# Altium project FLEXI_HAL_Quark.PrjPCB (part 2 of 5)

## Sheet 2CH_Digital_Isolator.SchDoc: STM32F446 CNC
size B; Author: AM; CompanyName: Expatria Technologies; DrawnBy: A.Marles; Engineer: AM; Organization: Expatria Technolgoies; DocumentNumber: 9; Revision: A1; SheetNumber: 9; SheetTotal: 14
Used 16 times, as channels STM32F446 CNC Controller/ST/AO, STM32F446 CNC Controller/ST/AO, STM32F446 CNC Controller/4 Encoder Inputs/EI, STM32F446 CNC Controller/4 Encoder Inputs/EI, STM32F446 CNC Controller/4 Encoder Inputs/EI, STM32F446 CNC Controller/4 Encoder Inputs/EI, STM32F446 CNC Controller/4 Encoder Inputs/EI, STM32F446 CNC Controller/4 Encoder Inputs/EI, STM32F446 CNC Controller/Mezzanine Connector/AUX_I/AI, STM32F446 CNC Controller/Mezzanine Connector/AUX_I/AI, STM32F446 CNC Controller/Mezzanine Connector/MZ, STM32F446 CNC Controller/Mezzanine Connector/MZ, STM32F446 CNC Controller/Mezzanine Connector/MZ, STM32F446 CNC Controller/Mezzanine Connector/MZ, STM32F446 CNC Controller/Mezzanine Connector/MZ, STM32F446 CNC Controller/Mezzanine Connector/MZ. Parts and nets are listed once, with the designators drawn on the sheet.
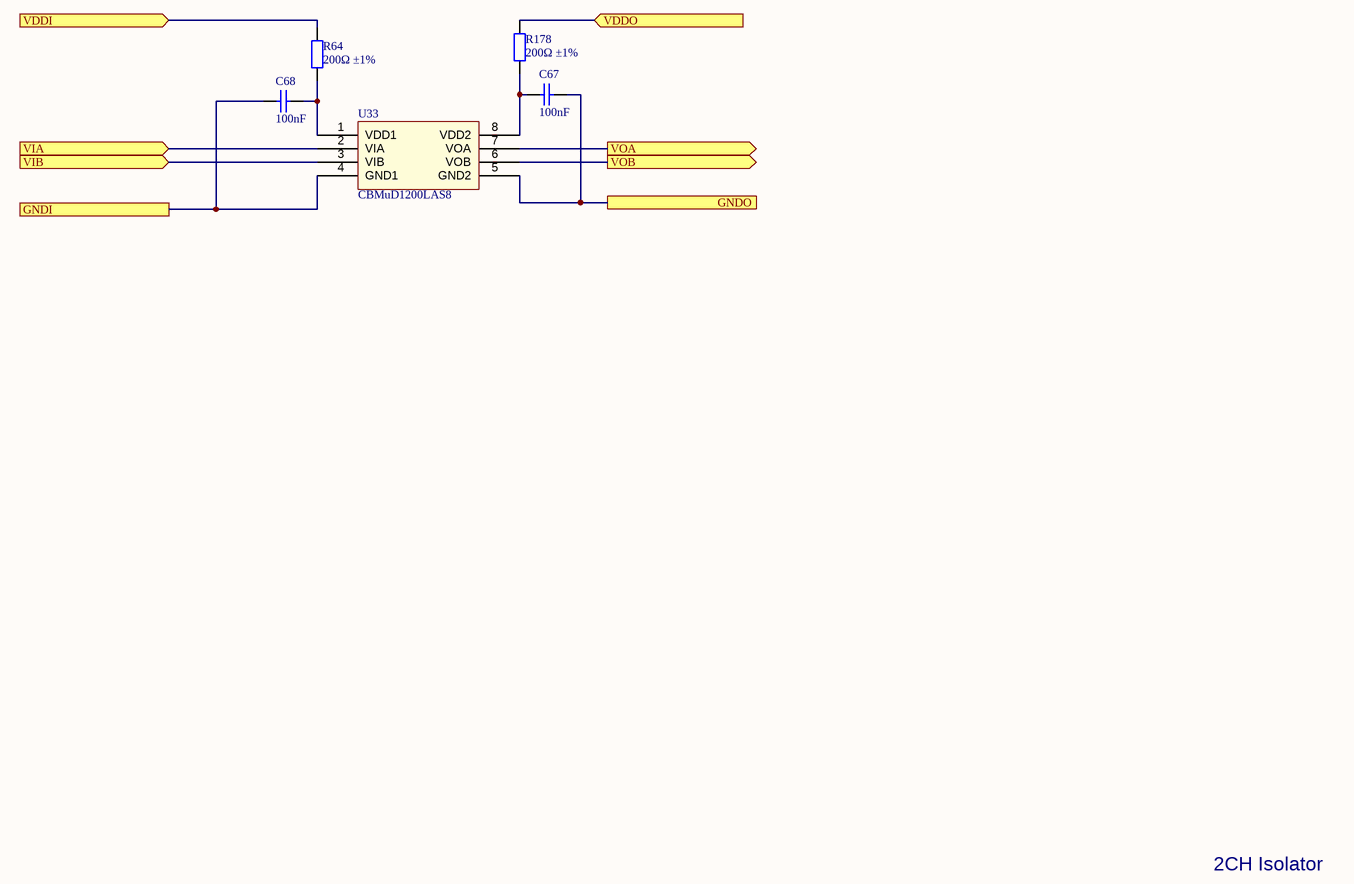
[diagram p4: 2CH_Digital_Isolator.SchDoc]

### Parts
C67  100nF  [0603_C]
C68  100nF  [0603_C]
R64  200Ω ±1%  [0603_R]
R178  200Ω ±1%  [0603_R]
U33  CBMuD1200LAS8  [SOIC-8_150mil]

### Ports
GNDI, GNDO, VDDI (in), VDDO (in), VIA (in), VIB (in), VOA (out), VOB (out)

### Nets
GNDI: C68.2 U33.4(GND1) ; port GNDI
GNDO: C67.1 U33.5(GND2) ; port GNDO
VDDI: R64.2 ; port VDDI
VDDO: R178.2 ; port VDDO
VIA: U33.2(VIA) ; port VIA
VIB: U33.3(VIB) ; port VIB
VOA: U33.7(VOA) ; port VOA
VOB: U33.6(VOB) ; port VOB
NetC67_2: C67.2 R178.1 U33.8(VDD2)
NetC68_1: C68.1 R64.1 U33.1(VDD1)

### Channels
STM32F446 CNC Controller/ST/AO: designators end in _STM32F446_CNC_Controller_ST_AO#1; ports GNDI=MCU_GND GNDO=GND VDDI=+3.3V VDDO=+5V VIA=SPI_MOTOR.SPI_CLK VIB=SPI_MOTOR.SPI_PICO VOA=STP_SCK_5V VOB=STP_SDI_5V
STM32F446 CNC Controller/ST/AO: designators end in _STM32F446_CNC_Controller_ST_AO#2; ports GNDI=GND GNDO=MCU_GND VDDI=+5V VDDO=+3.3V VIA=STP_SDO_5V VIB=VIB_AO VOA=SPI_MOTOR.SPI_POCI VOB=VOB_AO
STM32F446 CNC Controller/4 Encoder Inputs/EI: designators end in _STM32F446_CNC_Controller_4_Encoder_Inputs_EI#1; ports GNDI=GND GNDO=MCU_GND VDDI=+5V VDDO=+3.3V VIA=VIA VIB=VIB VOA=ENC0_A_3V3 VOB=ENC0_B_3V3
STM32F446 CNC Controller/4 Encoder Inputs/EI: designators end in _STM32F446_CNC_Controller_4_Encoder_Inputs_EI#2; ports GNDI=GND GNDO=MCU_GND VDDI=+5V VDDO=+3.3V VIA=VIA VIB=VIB VOA=ENC0_Z_3V3 VOB=ENC1_Z_3V3
STM32F446 CNC Controller/4 Encoder Inputs/EI: designators end in _STM32F446_CNC_Controller_4_Encoder_Inputs_EI#3; ports GNDI=GND GNDO=MCU_GND VDDI=+5V VDDO=+3.3V VIA=VIA VIB=VIB VOA=ENC1_B_3V3 VOB=ENC2_B_3V3
STM32F446 CNC Controller/4 Encoder Inputs/EI: designators end in _STM32F446_CNC_Controller_4_Encoder_Inputs_EI#4; ports GNDI=GND GNDO=MCU_GND VDDI=+5V VDDO=+3.3V VIA=VIA VIB=VIB VOA=ENC1_A_3V3 VOB=ENC2_Z_3V3
STM32F446 CNC Controller/4 Encoder Inputs/EI: designators end in _STM32F446_CNC_Controller_4_Encoder_Inputs_EI#5; ports GNDI=GND GNDO=MCU_GND VDDI=+5V VDDO=+3.3V VIA=VIA VIB=VIB VOA=ENC2_A_3V3 VOB=ENC3_A_3V3
STM32F446 CNC Controller/4 Encoder Inputs/EI: designators end in _STM32F446_CNC_Controller_4_Encoder_Inputs_EI#6; ports GNDI=GND GNDO=MCU_GND VDDI=+5V VDDO=+3.3V VIA=VIA VIB=VIB VOA=ENC3_Z_3V3 VOB=ENC3_B_3V3
STM32F446 CNC Controller/Mezzanine Connector/AUX_I/AI: designators end in _STM32F446_CNC_Controller_Mezzanine_Connector_AUX_I_AI#1; ports GNDI=GND GNDO=MCU_GND VDDI=+5V VDDO=+3.3V VIA=VIA VIB=VIB VOA=AUXIN_0 VOB=AUXIN_1
STM32F446 CNC Controller/Mezzanine Connector/AUX_I/AI: designators end in _STM32F446_CNC_Controller_Mezzanine_Connector_AUX_I_AI#2; ports GNDI=GND GNDO=MCU_GND VDDI=+5V VDDO=+3.3V VIA=VIA VIB=VIB VOA=AUXIN_2 VOB=AUXIN_3
STM32F446 CNC Controller/Mezzanine Connector/MZ: designators end in _STM32F446_CNC_Controller_Mezzanine_Connector_MZ#1; ports GNDI=MCU_GND GNDO=GND VDDI=+3.3V VDDO=+5V VIA=MIST VIB=COOLANT VOA=MIST_ISO VOB=COOLANT_ISO
STM32F446 CNC Controller/Mezzanine Connector/MZ: designators end in _STM32F446_CNC_Controller_Mezzanine_Connector_MZ#2; ports GNDI=MCU_GND GNDO=GND VDDI=+3.3V VDDO=+5V VIA=SPINDLE_EN VIB=SPINDLE_DIR VOA=SPINDLE_EN_ISO VOB=SPINDLE_DIR_ISO
STM32F446 CNC Controller/Mezzanine Connector/MZ: designators end in _STM32F446_CNC_Controller_Mezzanine_Connector_MZ#3; ports GNDI=MCU_GND GNDO=GND VDDI=+3.3V VDDO=+5V VIA=EXTRA_OUTPUT VIB=SPINDLE_PWM VOA=EXTRA_OUTPUT_ISO VOB=SPINDLE_PWM_ISO
STM32F446 CNC Controller/Mezzanine Connector/MZ: designators end in _STM32F446_CNC_Controller_Mezzanine_Connector_MZ#4; ports GNDI=MCU_GND GNDO=GND VDDI=+3.3V VDDO=+5V VIA=FASTO1 VIB=FASTO0 VOA=FASTO1_ISO VOB=FASTO0_ISO
STM32F446 CNC Controller/Mezzanine Connector/MZ: designators end in _STM32F446_CNC_Controller_Mezzanine_Connector_MZ#5; ports GNDI=MCU_GND GNDO=GND VDDI=+3.3V VDDO=+5V VIA=AUXOUT_2 VIB=AUXOUT_3 VOA=AUXOUT2_ISO VOB=AUXOUT3_ISO
STM32F446 CNC Controller/Mezzanine Connector/MZ: designators end in _STM32F446_CNC_Controller_Mezzanine_Connector_MZ#6; ports GNDI=MCU_GND GNDO=GND VDDI=+3.3V VDDO=+5V VIA=AUXOUT_0 VIB=AUXOUT_1 VOA=AUXOUT0_ISO VOB=AUXOUT1_ISO

### Notes on the sheet
- 2CH Isolator
- SHEET
- Expatria Technologies
- 1136 Glade Court
- Port Coquitlam, BC V3B 1R5
- PROJECT
- SIZE
- ENGR
- MODIFIED
- DOCUMENT
- REV
- Copyright Expatria Technologies 2022. This document describes Open Hardware and is licensed under the CERN-OHL-S v2. No warranty is implied or expressed.
- EMAIL: INFO@EXPATRIA.CA
- B
- /

### Library data of the parts
C67 C68 = 0603 100nF (104) 10% 50V: as C9 on sheet Stepper_driver_group; ComponentLink1Description: Supplier link; ComponentLink1URL: http://www.szlcsc.com/product/details_15331.html; Package: 0603; Supplier: LC; SuppliersPartNumber: C14663; Capacitance: 100nF
R64 R178 = 0603 200R (2000) 1%: Chip resistor; Manufacturer: Uniroyal Elec; PartNumber: 0603WAF2000T5E; Power: 1/10W; ComponentLink1Description: Supplier link; ComponentLink1URL: http://www.szlcsc.com/product/details_8708.html; Package: 0603; Supplier: LC; SuppliersPartNumber: C8218; Resistance: 200Ω; Tolerance: 1%
U33 = CBMuD1200LAS8: Dual Channel Isolator; Package: SOIC-8_150mil; Supplier: LC; SuppliersPartNumber: C476470; ComponentLink1Description: 供应商链接; ComponentLink1URL: http://www.szlcsc.com/product/details_10199.html

## Sheet RS485.SchDoc: RP2040 CNC
size B; Author: AM; CompanyName: Expatria Technologies; DrawnBy: A.Marles; Engineer: AM; Organization: Expatria Technolgoies; DocumentNumber: 6; Revision: A1; SheetNumber: 6; SheetTotal: 14
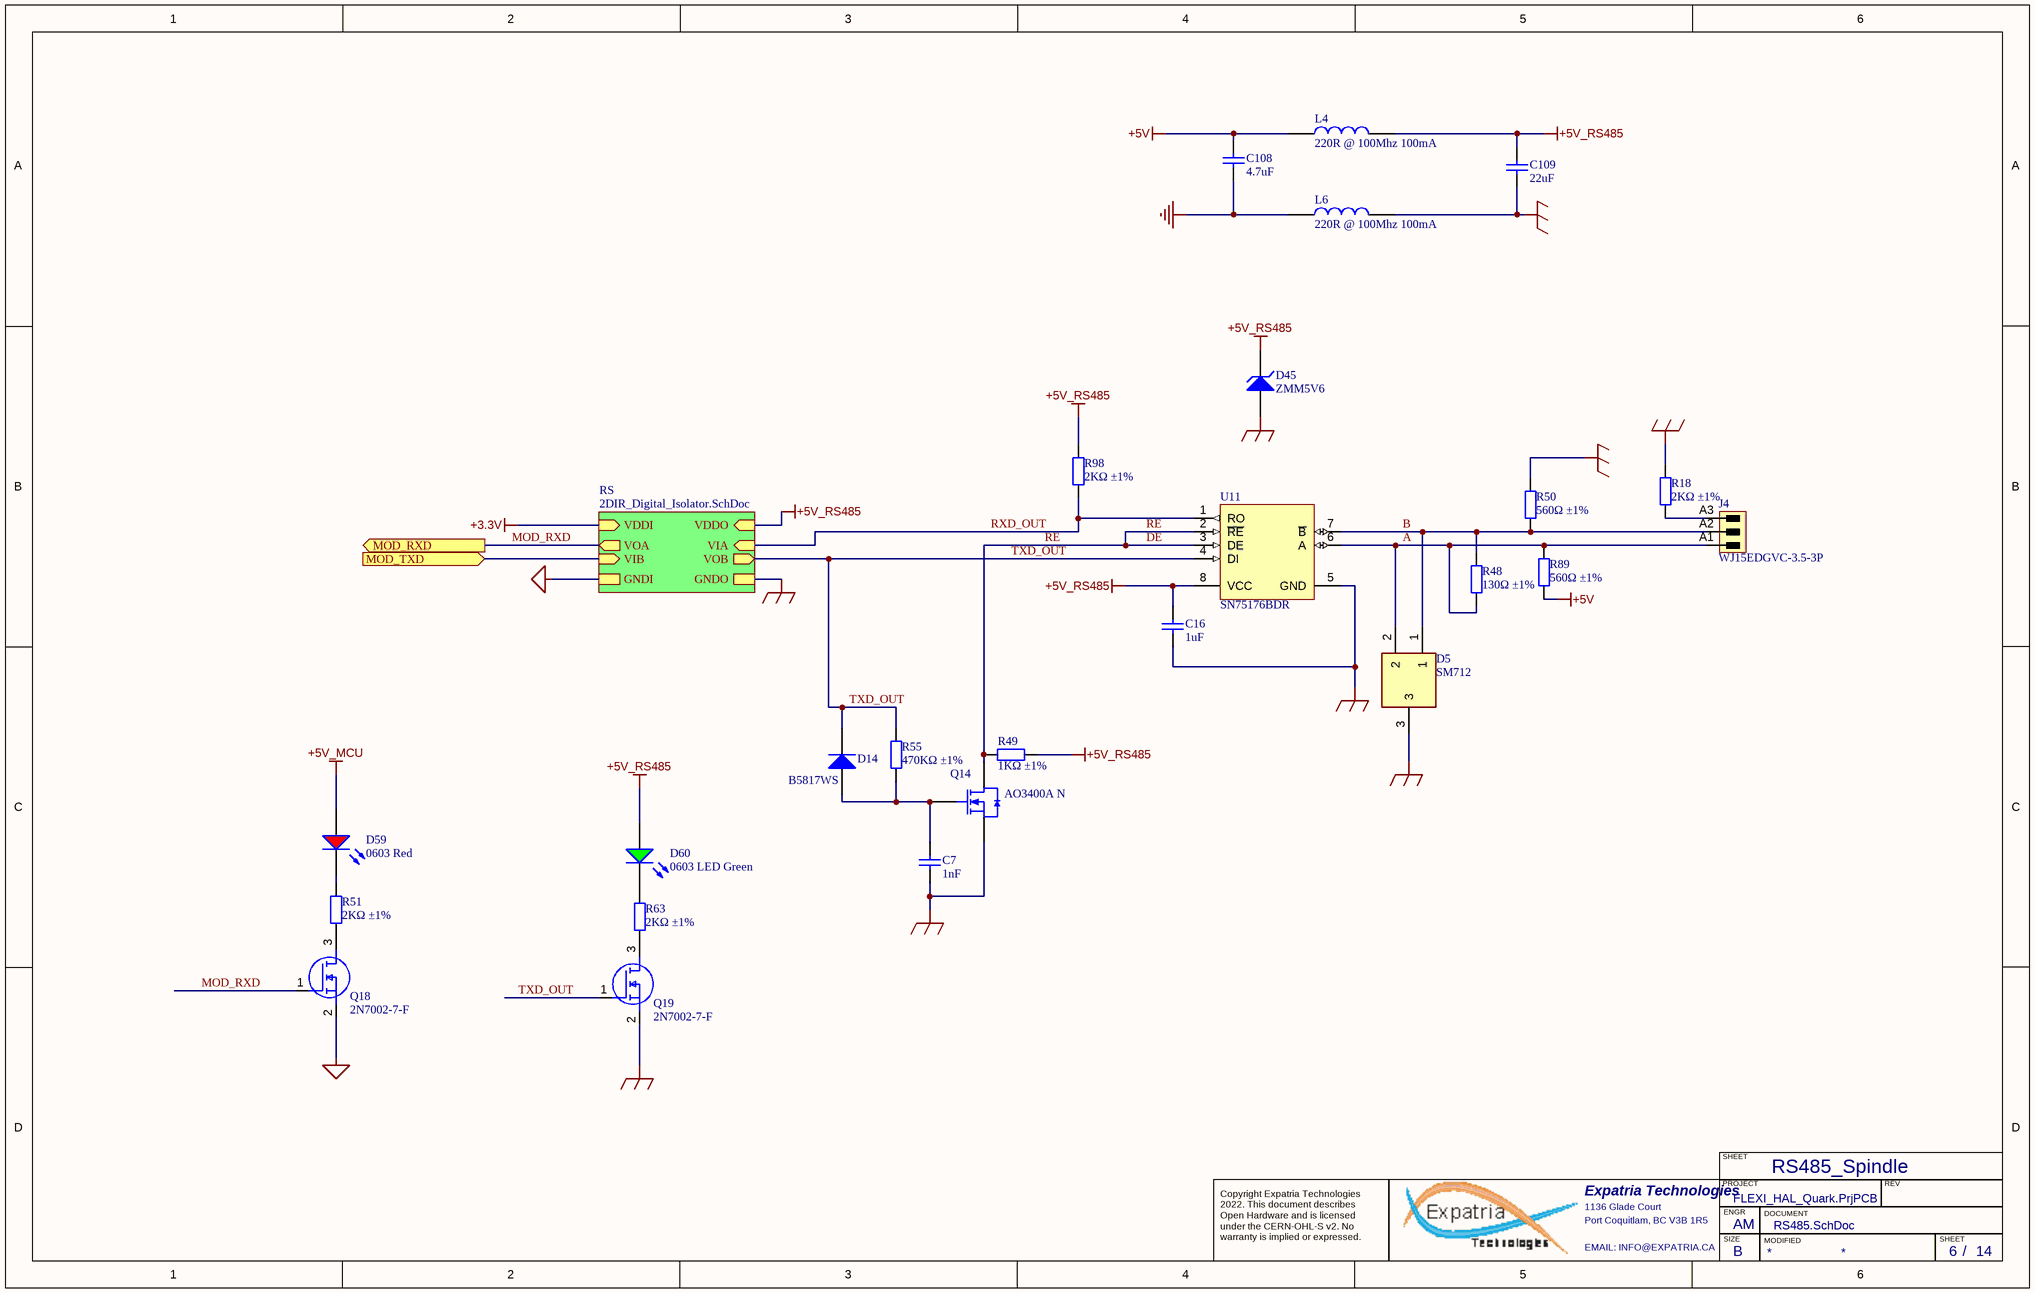
[diagram p5: RS485.SchDoc]

### Parts
C7  1nF  [0603_C]
C16  1uF  [0603_C]
C108  4.7uF  [0805_C]
C109  22uF  [0805_C]
D5  SM712  [SOT95P230X117-3N]
D14  B5817WS  [SOD-323]
D45  ZMM5V6  [LL-34]
D59  0603 Red  [0603_LED_S1]
D60  0603 LED Green  [0603_LED_S1]
J4  WJ15EDGVC-3.5-3P  [691321100003 - 3.5mm  3p]
L4  220R @ 100Mhz 100mA  [0402_L]
L6  220R @ 100Mhz 100mA  [0402_L]
Q14  AO3400A N  [SOT-23-3L]
Q18  2N7002-7-F  [SOT-23(SOT-23-3)]
Q19  2N7002-7-F  [SOT-23(SOT-23-3)]
R18  2KΩ ±1%  [0603_R]
R48  130Ω ±1%  [0603_R]
R49  1KΩ ±1%  [0603_R]
R50  560Ω ±1%  [0603_R]
R51  2KΩ ±1%  [0402_R]
R55  470KΩ ±1%  [0603_R]
R63  2KΩ ±1%  [0402_R]
R89  560Ω ±1%  [0603_R]
R98  2KΩ ±1%  [0603_R]
U11  SN75176BDR  [SOIC-8_150mil]

### Sub-sheets
RS = 2DIR_Digital_Isolator.SchDoc: VDDO (in), VIB (in), VIA (in), VOB (out), VOA (out), VDDI (in), GNDO, GNDI

### Ports
MOD_RXD (out), MOD_TXD (in)

### Nets
+5V: C108.2 L4.1 R89.2
+5V_MCU: D59.A
+5V_RS485: C16.2 C109.2 D45.2(K) D60.A L4.2 R49.1 R98.2 U11.8(VCC) ; sheet RS/VDDO
GND: C108.1 L6.1
MCU_GND: Q18.2(S) ; sheet RS/GNDI
MOD_GND: C7.2 C16.1 C109.1 D5.3 D45.1(A) L6.2 Q14.2(S) Q19.2(S) R18.1 R50.1 U11.5(GND) ; sheet RS/GNDO
A: D5.2 J4.A1 R48.1 R89.1 U11.6(A)
B: D5.1 J4.A2 R48.2 R50.2 U11.7(~{B})
DE: Q14.3(D) R49.2 U11.2(~{RE}) U11.3(DE)  [also labelled RE]
MOD_RXD: Q18.1(G) ; port MOD_RXD, sheet RS/VOA  [project net RXD_EXT]
RXD_OUT: R98.1 U11.1(RO) ; sheet RS/VIA
TXD_EXT: port MOD_TXD, sheet RS/VIB
TXD_OUT: D14.2(K) Q19.1(G) R55.1 U11.4(DI) ; sheet RS/VOB
NetC7_1: C7.1 D14.1(A) Q14.1(G) R55.2
NetD59_K: D59.K R51.2
NetD60_K: D60.K R63.2
NetJ4_A3: J4.A3 R18.2
NetQ18_3: Q18.3(D) R51.1
NetQ19_3: Q19.3(D) R63.1

### Notes on the sheet
- RS485_Spindle
- SHEET
- Expatria Technologies
- 1136 Glade Court
- Port Coquitlam, BC V3B 1R5
- PROJECT
- SIZE
- ENGR
- MODIFIED
- DOCUMENT
- REV
- Copyright Expatria Technologies 2022. This document describes Open Hardware and is licensed under the CERN-OHL-S v2. No warranty is implied or expressed.
- EMAIL: INFO@EXPATRIA.CA
- B
- /

### Library data of the parts
C7 = 0603 1nF (102) 10% 50V: Chip capacitors; Manufacturer: Samsung Electro-Mechanics; PartNumber: CL10B102KB8NNNC; Tolerance: 10%; Voltage: 50V; ComponentLink1Description: Supplier link; ComponentLink1URL: http://www.szlcsc.com/product/details_1940.html; Package: 0603; Supplier: LC; SuppliersPartNumber: C1588; Capacitance: 1nF
C16 = 0603 1uF (105) 10% 50V: Chip capacitors; Manufacturer: Samsung Electro-Mechanics; PartNumber: CL10A105KB8NNNC; Tolerance: 10%; Voltage: 50V; ComponentLink1Description: Supplier link; ComponentLink1URL: http://www.szlcsc.com/product/details_16531.html; Package: 0603; Supplier: LC; SuppliersPartNumber: C15849; Capacitance: 1uF
C108 = 0805 4.7uF (475) 10% 25V: Chip capacitors; Manufacturer: Samsung Electro-Mechanics; PartNumber: CL21A475KAQNNNE; Tolerance: 10%; Voltage: 25V; ComponentLink1Description: Supplier link; ComponentLink1URL: http://www.szlcsc.com/product/details_2131.html; Package: 0805; Supplier: LC; SuppliersPartNumber: C1779; Capacitance: 4.7uF
C109 = 0805 22uF (226) 20% 25V: Chip capacitors; Manufacturer: Samsung Electro-Mechanics; PartNumber: CL21A226MAQNNNE; Tolerance: 20%; Voltage: 25V; ComponentLink1Description: Supplier link; ComponentLink1URL: http://www.szlcsc.com/product/details_46786.html; Package: 0805; Supplier: LC; SuppliersPartNumber: C45783; Capacitance: 22uF
D5 = CDSOT23-SM712: Bidirectional 12V (Max), 7V (Max) 7.5V / 13.3V 10V / 20V 12A(8/20us) SOT-23-3 TVS RoHS; Manufacturer_Name: DOWO; Height: 1.17mm; Manufacturer_Part_Number: SM712; SuppliersPartNumber: C293966
D14 = SOD-123 B5819W  SL: 20V 750mV@3A 1A SOD-323 Schottky Barrier Diodes (SBD) ROHS; Package: SOD-323; Supplier: LC; SuppliersPartNumber: C699102
D45 = LL-34 ZMM5V6: 500mW - 0.1uA @ 1V 5.6V LL-34 Zener Diodes ROHS; ComponentLink1Description: 供应商链接; ComponentLink1URL: http://www.szlcsc.com/product/details_8541.html; Package: LL-34; Supplier: LC; SuppliersPartNumber: C8062
D59 = 19-213SURC/S530-A3/TR8: 20mA 632nm Colorless transparence 624nm~624nm -40℃~+85℃ Red 120° 60mW 0603 Light Emitting Diodes (LED) ROHS; Manufacturer: Everlight Elec; ComponentLink1Description: 供应商链接; ComponentLink1URL: http://www.szlcsc.com/product/details_2659.html; Package: 0603; Supplier: LC; SuppliersPartNumber: C72039; Color: Red; Supplier 1: LC; Supplier Part Number 1: C72039; Manufacturer Part Number: 19-213SURC/S530-A3/TR8
D60 = 19-217/GHC-YR1S2/3T: Colorless transparence -40℃~+85℃ 520nm~535nm Emerald 120° 110mW 0603 Light Emitting Diodes (LED) ROHS; Manufacturer: Everlight Elec; Package: 0603; Supplier: LC; SuppliersPartNumber: C72043; Color: Green; Manufacturer Part Number: 19-217/GHC-YR1S2/3T
J4 = 3.5mm Terminal Header 3p: Header,Male Pin,Covered(4 Sided) 3 1 0.138"（3.50mm） 3 P=3.5mm Pluggable System Terminal Block RoHS; Manufacturer: Ningbo Kangnex Elec; Pitch_mm: 3.5 mm; UL_94_flammability_rating: V-0; Side_termination_characteristic: closed side; Solder_pin_length_mm: 3.2 mm; Short_text_for_material: SL 3.50/03/180G 3.2SN OR BX; Pitch_inch: 0.138 inch; PartNumber: WJ15EDGVC-3.5-3P; PackageReference: SL_3_50_180G_03; ComponentLink1URL: http://www.weidmueller.com/; ComponentLink1Description: Manufacturer URL; Packaging: Box; Revision: V1; SuppliersPartNumber: C192778; Manufacturer 1: Ningbo Kangnex Elec; Manufacturer Part Number 1: WJ15EDGVC-3.5-3P; Package: P=3.5mm
L4 L6 = 0402 220R@100Mhz 0.1A: Ferrite Bead; Notepad: *; Package: 0402; Supplier: LC; SuppliersPartNumber: C92617
Q14 = AO3400A N道沟 X0YV1T SOT-23: MOS(场效应管); ComponentLink1Description: 供应商链接; ComponentLink1URL: http://www.szlcsc.com/product/details_21629.html; Package: SOT-23; Supplier: LC; SuppliersPartNumber: C20917
Q18 Q19 = 2N7002-7-F: 60V 115mA 7.5Ω@5V,50mA 370mW N Channel SOT-23 MOSFETs ROHS; Manufacturer: Diodes Inc.; SuppliersPartNumber: C85049; Manufacturer Part Number: 2N7002-7-F; Value: 2N7002-7-F; Datasheet Link: https://datasheet.datasheetarchive.com/originals/distributors/SFDatasheet-0/sf-0003625.pdf; Height: 1.2mm; Manufacturer_Part_Number: 2N7002-7-F; Mouser Part Number: 621-2N7002-F; Mouser Price/Stock: https://www.mouser.co.uk/ProductDetail/Diodes-Incorporated/2N7002-7-F?qs=jMXWnm70%252BC%252BAX%252BMLzUkTZg%3D%3D; Arrow Part Number: 2N7002-7-F; Arrow Price/Stock: https://www.arrow.com/en/products/2n7002-7-f/diodes-incorporated?region=nac
R18 R98 = 0603 2K (2001) 1%: Chip resistor; Manufacturer: Uniroyal Elec; PartNumber: 0603WAF2001T5E; Power: 1/10W; ComponentLink1Description: Supplier link; ComponentLink1URL: http://www.szlcsc.com/product/details_23702.html; Package: 0603; Supplier: LC; SuppliersPartNumber: C22975; Resistance: 2KΩ; Tolerance: 1%
R48 = 0603 130R (1300) 1%: Chip resistor; Manufacturer: Uniroyal Elec; PartNumber: 0603WAF1300T5E; Power: 1/10W; ComponentLink1Description: Supplier link; ComponentLink1URL: http://www.szlcsc.com/product/details_23523.html; Package: 0603; Supplier: LC; SuppliersPartNumber: C22796; Resistance: 130Ω; Tolerance: 1%
R49 = 0603 1K (1001) 1%: Chip resistor; Manufacturer: Uniroyal Elec; PartNumber: 0603WAF1001T5E; Power: 1/10W; ComponentLink1Description: Supplier link; ComponentLink1URL: http://www.szlcsc.com/product/details_21904.html; Package: 0603; Supplier: LC; SuppliersPartNumber: C21190; Resistance: 1KΩ; Tolerance: 1%
R50 R89 = 0603 560R (5600) 1%: Chip resistor; Manufacturer: Uniroyal Elec; PartNumber: 0603WAF5600T5E; Power: 1/10W; ComponentLink1Description: Supplier link; ComponentLink1URL: http://www.szlcsc.com/product/details_23931.html; Package: 0603; Supplier: LC; SuppliersPartNumber: C23204; Resistance: 560Ω; Tolerance: 1%
R51 R63 = 0402 2K (2001) 1%: Chip resistor; Manufacturer: Uniroyal Elec; Manufacturer Part Number: 0402WGF2001TCE; Power: 1/16W; ComponentLink1Description: Supplier link; ComponentLink1URL: http://www.szlcsc.com/product/details_4516.html; Package: 0402; Supplier: LC; SuppliersPartNumber: C4109; Resistance: 2KΩ; Tolerance: 1%
R55 = 0603 470K (4703) 1%: Chip resistor; Manufacturer: Uniroyal Elec; PartNumber: 0603WAF4703T5E; Power: 1/10W; ComponentLink1Description: Supplier link; ComponentLink1URL: http://www.szlcsc.com/product/details_23905.html; Package: 0603; Supplier: LC; SuppliersPartNumber: C23178; Resistance: 470KΩ; Tolerance: 1%
U11 = SN75176BDR_[C7063]: RS-485/RS-422; ComponentLink1Description: 供应商链接; ComponentLink1URL: http://www.szlcsc.com/product/details_7535.html; Package: SOIC-8_150mil; Supplier: LC; SuppliersPartNumber: C7063

## Sheet 2DIR_Digital_Isolator.SchDoc: STM32F446 CNC
size B; Author: AM; CompanyName: Expatria Technologies; DrawnBy: A.Marles; Engineer: AM; Organization: Expatria Technolgoies; DocumentNumber: 9; Revision: A1; SheetNumber: 9; SheetTotal: 14
Used 2 times, as channels STM32F446 CNC Controller/MODBUS/RS, STM32F446 CNC Controller/Pendant RT Interface/CB. Parts and nets are listed once, with the designators drawn on the sheet.
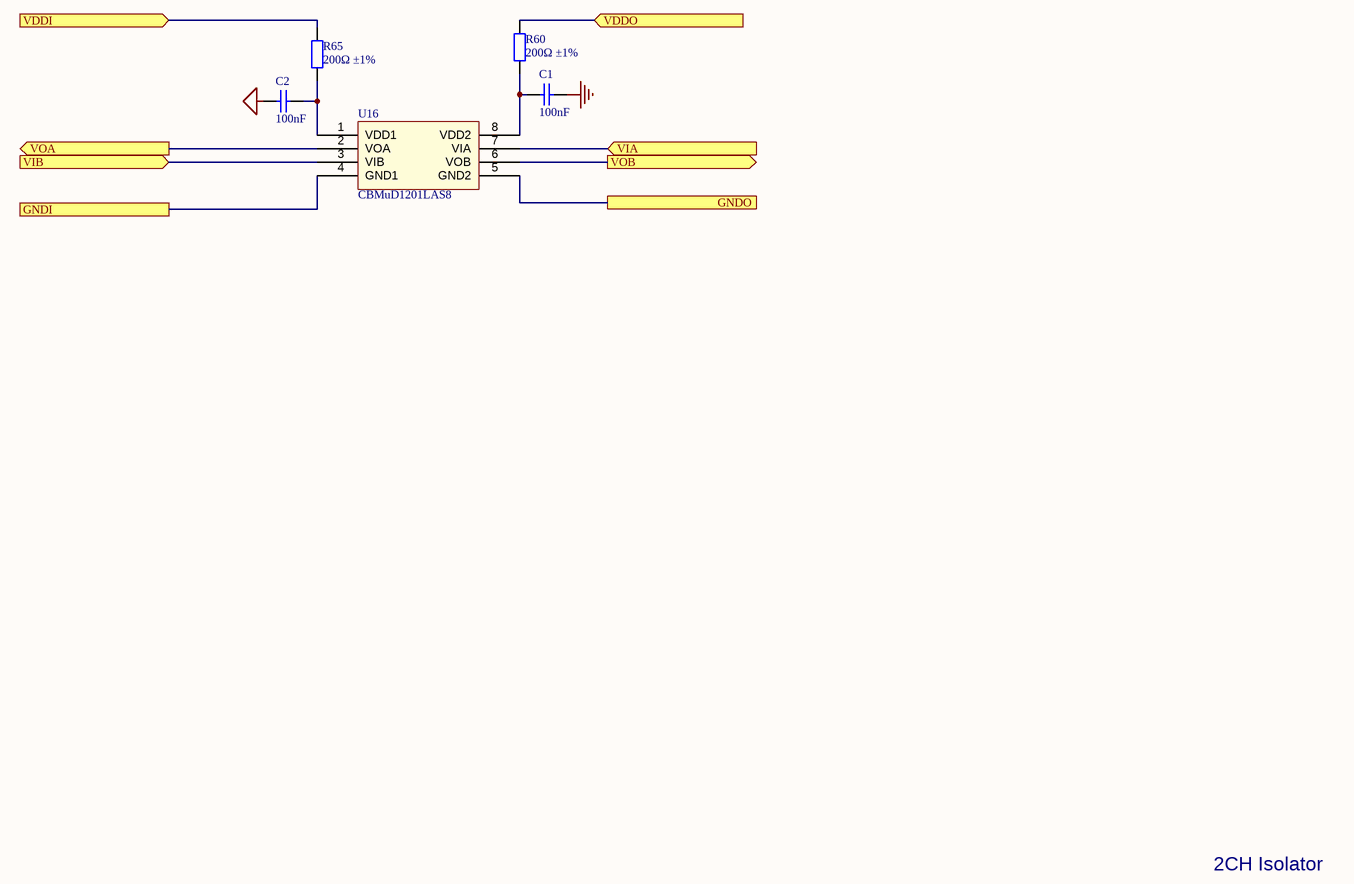
[diagram p6: 2DIR_Digital_Isolator.SchDoc]

### Parts
C1  100nF  [0603_C]
C2  100nF  [0603_C]
R60  200Ω ±1%  [0603_R]
R65  200Ω ±1%  [0603_R]
U16  CBMuD1201LAS8  [SOIC-8_150mil]

### Ports
GNDI, GNDO, VDDI (in), VDDO (in), VIA (in), VIB (in), VOA (out), VOB (out)

### Nets
GND: C1.1
MCU_GND: C2.2
GNDI: U16.4(GND1) ; port GNDI
GNDO: U16.5(GND2) ; port GNDO
VDDI: R65.2 ; port VDDI
VDDO: R60.2 ; port VDDO
VIA: U16.7(VIA) ; port VIA
VIB: U16.3(VIB) ; port VIB
VOA: U16.2(VOA) ; port VOA
VOB: U16.6(VOB) ; port VOB
NetC1_2: C1.2 R60.1 U16.8(VDD2)
NetC2_1: C2.1 R65.1 U16.1(VDD1)

### Channels
STM32F446 CNC Controller/MODBUS/RS: designators end in _RS; ports GNDI=MCU_GND GNDO=MOD_GND VDDI=+3.3V VDDO=+5V_RS485 VIA=RXD_OUT VIB=TXD_EXT VOA=RXD_EXT VOB=TXD_OUT
STM32F446 CNC Controller/Pendant RT Interface/CB: designators end in _CB; ports GNDI=MCU_GND GNDO=GND VDDI=+3.3V VDDO=+5V VIA=VIA VIB=CAN_TX VOA=CAN_RX VOB=CAN_TX_5V

### Notes on the sheet
- 2CH Isolator
- SHEET
- Expatria Technologies
- 1136 Glade Court
- Port Coquitlam, BC V3B 1R5
- PROJECT
- SIZE
- ENGR
- MODIFIED
- DOCUMENT
- REV
- Copyright Expatria Technologies 2022. This document describes Open Hardware and is licensed under the CERN-OHL-S v2. No warranty is implied or expressed.
- EMAIL: INFO@EXPATRIA.CA
- B
- /

### Library data of the parts
C1 C2 = 0603 100nF (104) 10% 50V: as C9 on sheet Stepper_driver_group; ComponentLink1Description: Supplier link; ComponentLink1URL: http://www.szlcsc.com/product/details_15331.html; Package: 0603; Supplier: LC; SuppliersPartNumber: C14663; Capacitance: 100nF
R60 R65 = 0603 200R (2000) 1%: as R64 on sheet 2CH_Digital_Isolator; ComponentLink1Description: Supplier link; ComponentLink1URL: http://www.szlcsc.com/product/details_8708.html; Package: 0603; Supplier: LC; SuppliersPartNumber: C8218; Resistance: 200Ω; Tolerance: 1%
U16 = CBMuD1201LAS8: Dual Channel Isolator; Manufacturer: Corebai Microelectronics; Package: SOIC-8_150mil; Supplier: LC; SuppliersPartNumber: C476472; ComponentLink1Description: 供应商链接; ComponentLink1URL: http://www.szlcsc.com/product/details_10199.html; Manufacturer Part Number: CBMuD1201LAS8

## Sheet MCU_STM32H723ZGT6.SchDoc: STM32F446 CNC
size C; Author: AM; CompanyName: Expatria Technologies; DrawnBy: A.Marles; Engineer: AM; Organization: Expatria Technologies; DocumentNumber: 3; Revision: A1; SheetNumber: 3; SheetTotal: 14
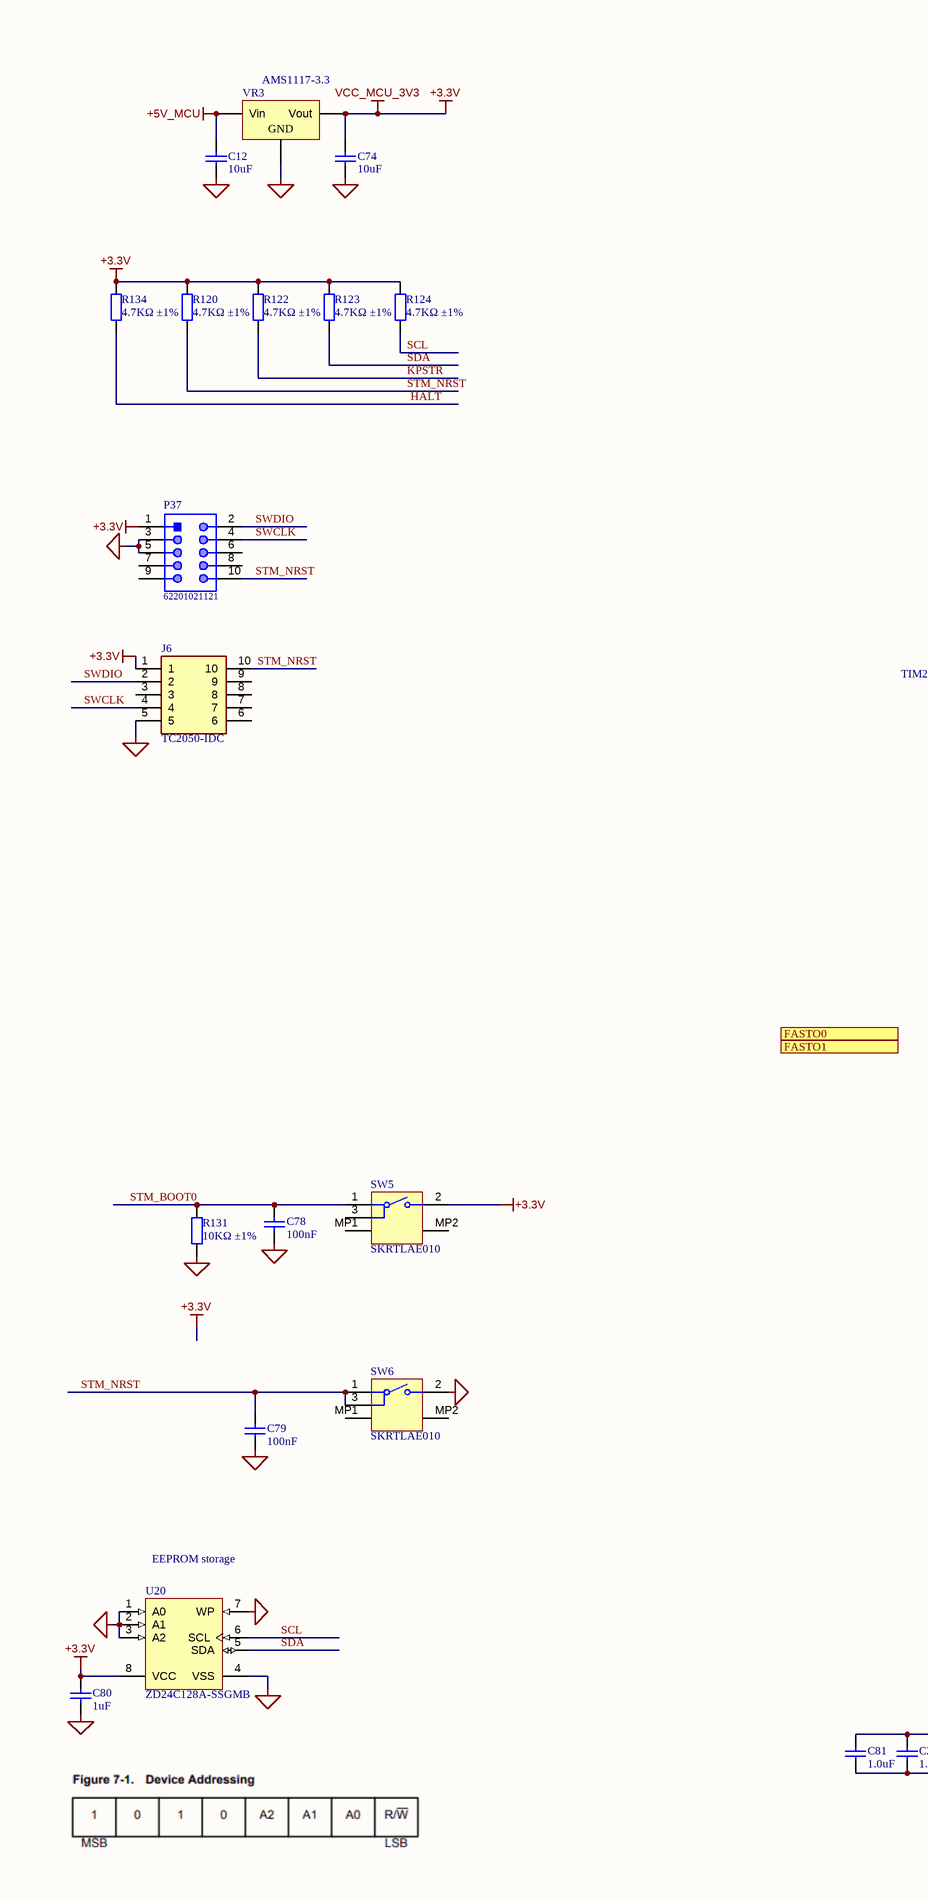
[diagram p7: MCU_STM32H723ZGT6.SchDoc, left]
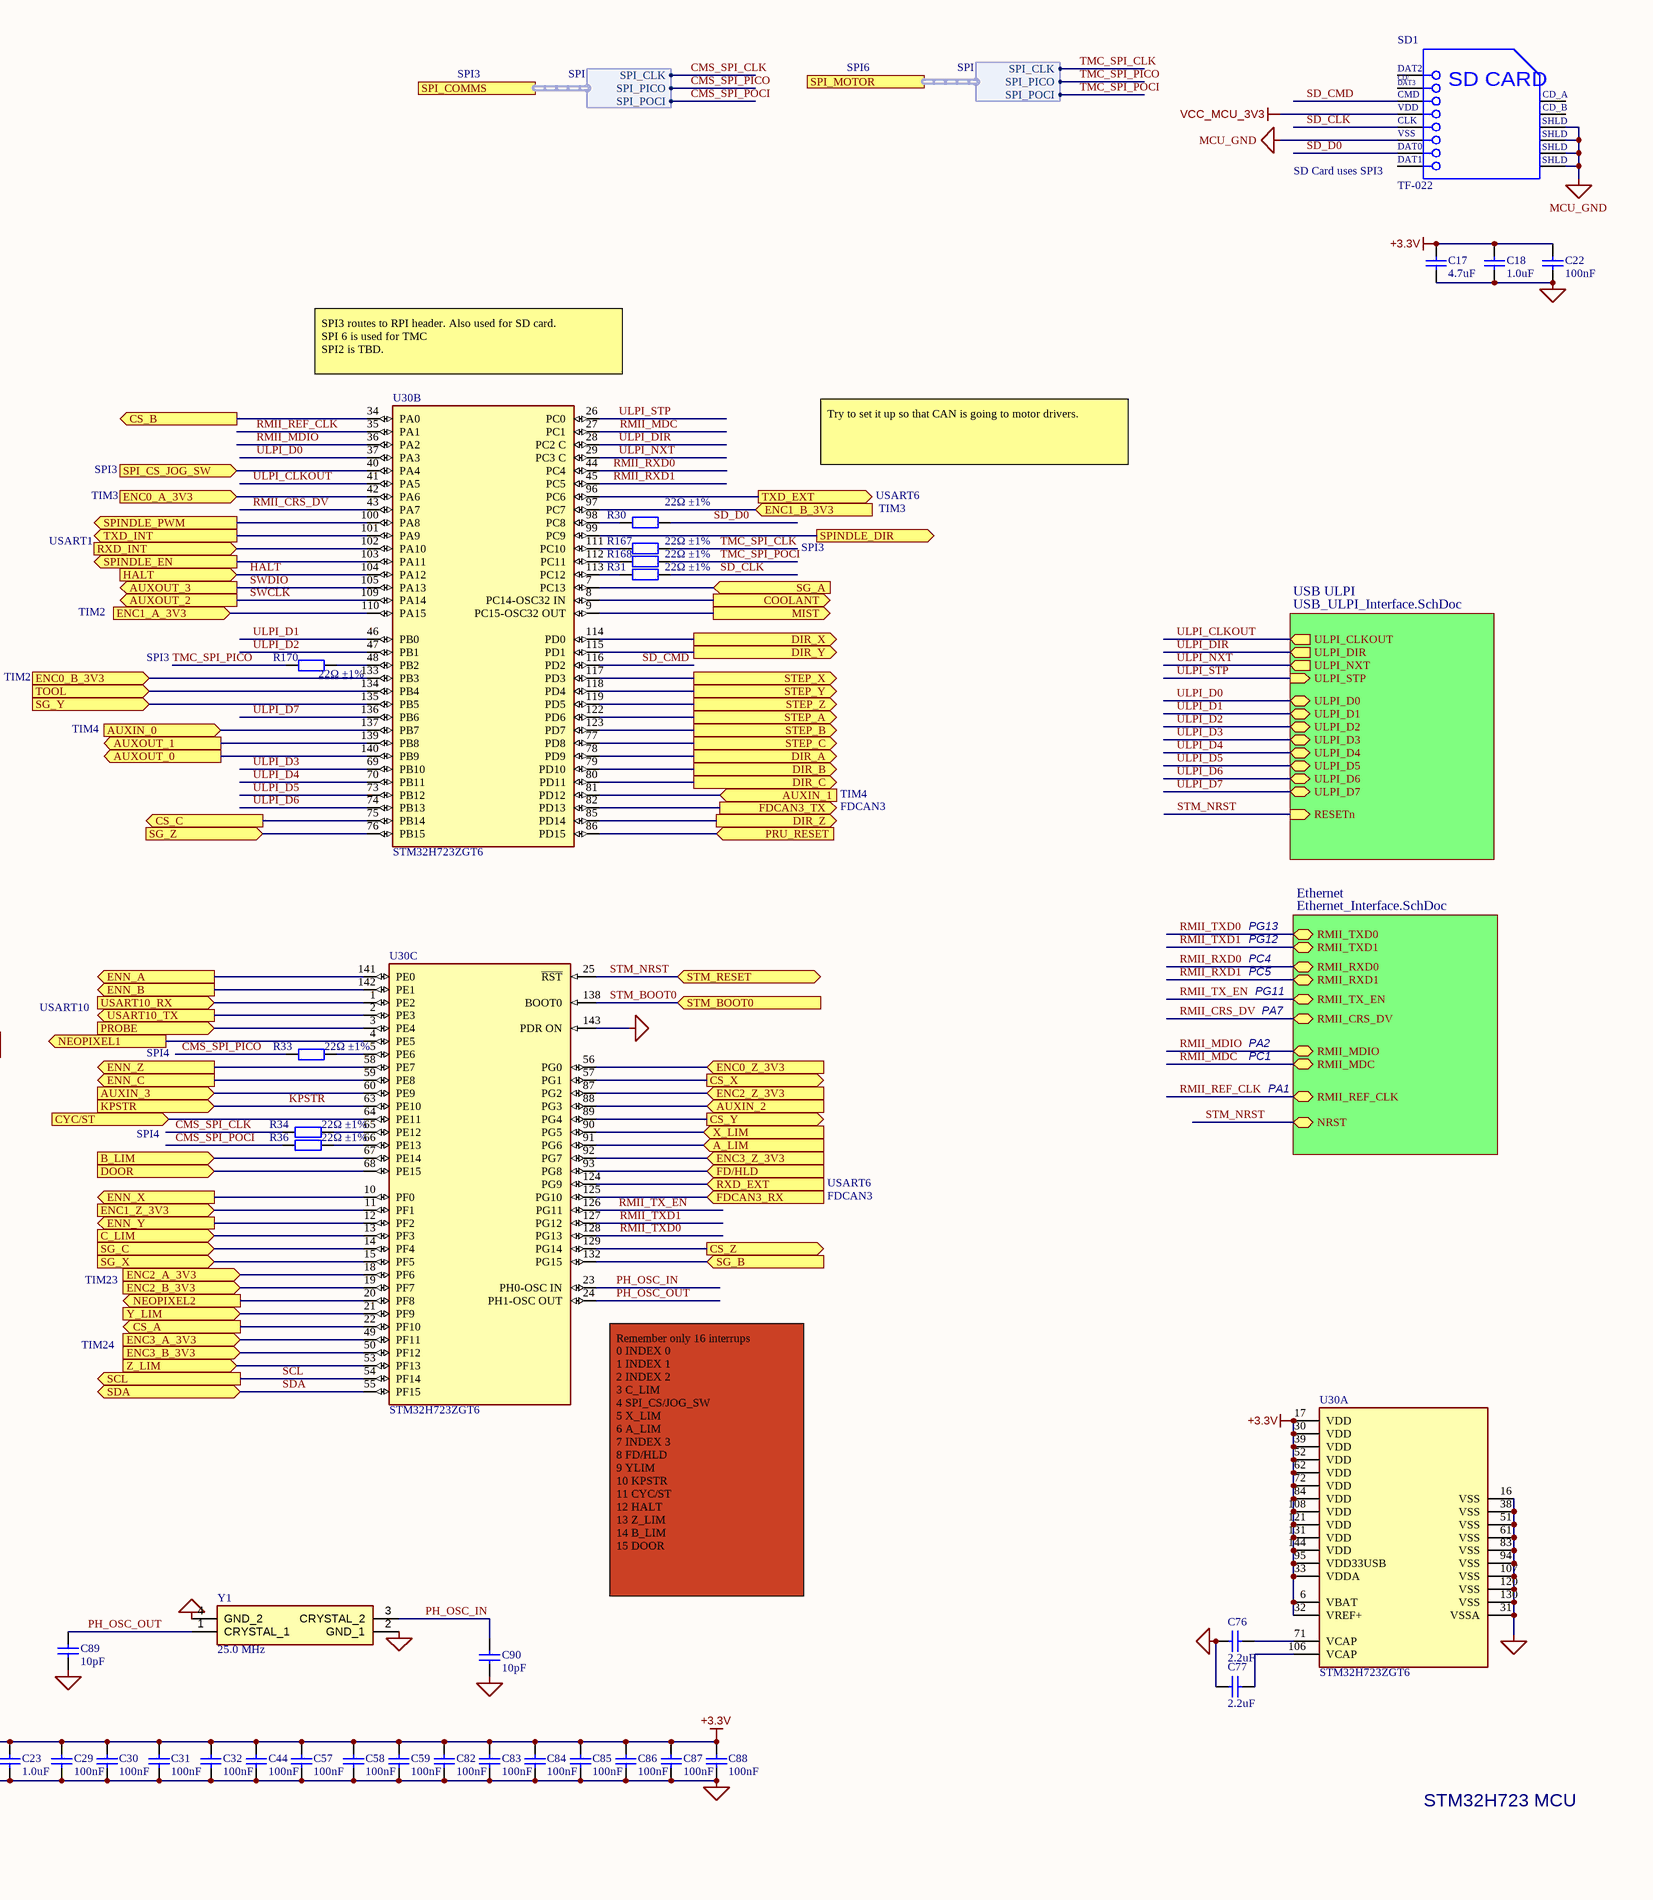
[diagram p8: MCU_STM32H723ZGT6.SchDoc, right]

### Parts
C12  10uF  [1206_C]
C17  4.7uF  [0603_C]
C18  1.0uF  [0402_C]
C22  100nF  [0402_C]
C23  1.0uF  [0402_C]
C29  100nF  [0402_C]
C30  100nF  [0402_C]
C31  100nF  [0402_C]
C32  100nF  [0402_C]
C44  100nF  [0402_C]
C57  100nF  [0402_C]
C58  100nF  [0402_C]
C59  100nF  [0402_C]
C74  10uF  [1206_C]
C76  2.2uF  [0603_C]
C77  2.2uF  [0603_C]
C78  100nF  [0603_C]
C79  100nF  [0603_C]
C80  1uF  [0603_C]
C81  1.0uF  [0402_C]
C82  100nF  [0402_C]
C83  100nF  [0402_C]
C84  100nF  [0402_C]
C85  100nF  [0402_C]
C86  100nF  [0402_C]
C87  100nF  [0402_C]
C88  100nF  [0402_C]
C89  10pF  [0402_C]
C90  10pF  [0402_C]
J6  TC2050-IDC  [TC2050-IDC]
P37  62201021121  [62201021121]  (no BOM)
R30  22Ω ±1%  [0402_R]
R31  22Ω ±1%  [0402_R]
R33  22Ω ±1%  [0402_R]
R34  22Ω ±1%  [0402_R]
R36  22Ω ±1%  [0402_R]
R120  4.7KΩ ±1%  [0603_R]
R122  4.7KΩ ±1%  [0603_R]
R123  4.7KΩ ±1%  [0603_R]
R124  4.7KΩ ±1%  [0603_R]
R131  10KΩ ±1%  [0603_R]
R134  4.7KΩ ±1%  [0603_R]
R167  22Ω ±1%  [0402_R]
R168  22Ω ±1%  [0402_R]
R170  22Ω ±1%  [0402_R]
SD1  TF-022  [MOLX-503398-1892_V]
SW5  SKRTLAE010  [ALPS-SKRTLAE010_V]
SW6  SKRTLAE010  [ALPS-SKRTLAE010_V]
U20  ZD24C128A-SSGMB  [SOIC-SN8_L]
U30  STM32H723ZGT6  [FP-LQFP144-1A-IPC_A]  (parts A,B,C of 3)
VR3  AMS1117-3.3  [SOT-223]
Y1  25.0 MHz  [YSX321SL]

### Sub-sheets
Ethernet = Ethernet_Interface.SchDoc: RMII_RXD1 (bidir), RMII_MDC (bidir), RMII_REF_CLK (bidir), RMII_MDIO (bidir), RMII_RXD0 (bidir), RMII_TX_EN (bidir), NRST (bidir), RMII_CRS_DV (bidir), RMII_TXD0 (bidir), RMII_TXD1 (bidir)
USB ULPI = USB_ULPI_Interface.SchDoc: ULPI_D5 (bidir), ULPI_D7 (bidir), ULPI_D6 (bidir), ULPI_D4 (bidir), ULPI_D0 (bidir), ULPI_D2 (bidir), ULPI_D3 (bidir), ULPI_D1 (bidir), ULPI_NXT (out), ULPI_DIR (out), ULPI_STP (in), ULPI_CLKOUT (out), RESETn (in)

### Ports
A_LIM (in), AUXIN_0 (in), AUXIN_1 (in), AUXIN_2 (in), AUXIN_3 (in), AUXOUT_0 (out), AUXOUT_1 (out), AUXOUT_2 (out), AUXOUT_3 (out), B_LIM (in), C_LIM (in), COOLANT (out), CS_A (out), CS_B (out), CS_C (out), CS_X (out), CS_Y (out), CS_Z (out), CYC/ST (in), DIR_A (out), DIR_B (out), DIR_C (out), DIR_X (out), DIR_Y (out), DIR_Z (out), DOOR (in), ENC0_A_3V3 (in), ENC0_B_3V3 (in), ENC0_Z_3V3 (in), ENC1_A_3V3 (in), ENC1_B_3V3 (in), ENC1_Z_3V3 (in), ENC2_A_3V3 (in), ENC2_B_3V3 (in), ENC2_Z_3V3 (in), ENC3_A_3V3 (in), ENC3_B_3V3 (in), ENC3_Z_3V3 (in), ENN_A (out), ENN_B (out), ENN_C (out), ENN_X (out), ENN_Y (out), ENN_Z (out), FASTO0 (out), FASTO1 (out), FD/HLD (in), FDCAN3_RX (in), FDCAN3_TX (out), HALT (in), KPSTR (in), MIST (out), NEOPIXEL1 (out), NEOPIXEL2 (out), PROBE (in), PRU_RESET (in), RXD_EXT (in), RXD_INT (in), SCL (out), SDA (bidir), SG_A (in), SG_B (in), SG_C (in), SG_X (in), SG_Y (in), SG_Z (in), SPI_COMMS (harness SPI), SPI_CS_JOG_SW (in), SPI_MOTOR (harness SPI), SPINDLE_DIR (out), SPINDLE_EN (out), SPINDLE_PWM (out), STEP_A (out), STEP_B (out), STEP_C (out), STEP_X (out), STEP_Y (out), STEP_Z (out), STM_BOOT0 (in), STM_RESET (bidir), TOOL (in), TXD_EXT (out), TXD_INT (out), USART10_RX (in), USART10_TX (out), X_LIM (in), Y_LIM (in), Z_LIM (in)

### Harnesses
SPI: SPI_CLK, SPI_PICO, SPI_POCI

### Nets
+3.3V: C17.2 C18.2 C22.2 C23.2 C29.2 C30.2 C31.2 C32.2 C44.2 C57.2 C58.2 C59.2 C74.2 C80.2 C81.2 C82.2 C83.2 C84.2 C85.2 C86.2 C87.2 C88.2 J6.1 P37.1 R120.2 R122.2 R123.2 R124.2 R134.2 SD1.4(VDD) SW5.2 U20.8(VCC) U30.6(VBAT) U30.17(VDD) U30.30(VDD) U30.32(VREF+) U30.33(VDDA) U30.39(VDD) U30.52(VDD) U30.62(VDD) U30.72(VDD) U30.84(VDD) U30.95(VDD33USB) U30.108(VDD) U30.121(VDD) U30.131(VDD) U30.144(VDD) VR3.2(Vout)  [also labelled VCC_MCU_3V3]
+5V_MCU: C12.2 VR3.3(Vin)
MCU_GND: C12.1 C17.1 C18.1 C22.1 C23.1 C29.1 C30.1 C31.1 C32.1 C44.1 C57.1 C58.1 C59.1 C74.1 C76.1 C77.1 C78.1 C79.1 C80.1 C81.1 C82.1 C83.1 C84.1 C85.1 C86.1 C87.1 C88.1 C89.1 C90.1 J6.5 P37.3 P37.5 R131.2 SD1.6(VSS) SD1.11(SHLD) SD1.12(SHLD) SD1.13(SHLD) SD1.14(SHLD) SW6.2 U20.1(A0) U20.2(A1) U20.3(A2) U20.4(VSS) U20.7(WP) U30.16(VSS) U30.31(VSSA) U30.38(VSS) U30.51(VSS) U30.61(VSS) U30.83(VSS) U30.94(VSS) U30.107(VSS) U30.120(VSS) U30.130(VSS) U30.143(PDR_ON) VR3.1(GND) Y1.2(GND_1) Y1.4(GND_2)
A_LIM: U30.91(PG6) ; port A_LIM
AUXIN_0: U30.137(PB7) ; port AUXIN_0
AUXIN_1: U30.81(PD12) ; port AUXIN_1
AUXIN_2: U30.88(PG3) ; port AUXIN_2
AUXIN_3: U30.60(PE9) ; port AUXIN_3
AUXOUT_0: U30.140(PB9) ; port AUXOUT_0
AUXOUT_1: U30.139(PB8) ; port AUXOUT_1
B_LIM: U30.67(PE14) ; port B_LIM
C_LIM: U30.13(PF3) ; port C_LIM
CAN_RX: U30.125(PG10) ; port FDCAN3_RX
CAN_TX: U30.82(PD13) ; port FDCAN3_TX
CMS_SPI_CLK: R34.1 ; port SPI_COMMS.SPI_CLK  [project net SPI_COMMS.SPI_CLK]
CMS_SPI_PICO: R33.1 ; port SPI_COMMS.SPI_PICO  [project net SPI_COMMS.SPI_PICO]
CMS_SPI_POCI: R36.1 ; port SPI_COMMS.SPI_POCI  [project net SPI_COMMS.SPI_POCI]
COOLANT: U30.8(PC14-OSC32_IN) ; port COOLANT
CS_A: U30.22(PF10) ; port CS_A
CS_B: U30.34(PA0) ; port CS_B
CS_C: U30.75(PB14) ; port CS_C
CS_X: U30.57(PG1) ; port CS_X
CS_Y: U30.89(PG4) ; port CS_Y
CS_Z: U30.129(PG14) ; port CS_Z
CYC/ST: U30.64(PE11) ; port CYC/ST
DIR_A: U30.78(PD9) ; port DIR_A
DIR_B: U30.79(PD10) ; port DIR_B
DIR_C: U30.80(PD11) ; port DIR_C
DIR_X: U30.114(PD0) ; port DIR_X
DIR_Y: U30.115(PD1) ; port DIR_Y
DIR_Z: U30.85(PD14) ; port DIR_Z
DOOR: U30.68(PE15) ; port DOOR
ENC0_A_3V3: U30.42(PA6) ; port ENC0_A_3V3
ENC0_B_3V3: U30.133(PB3) ; port ENC0_B_3V3
ENC0_Z_3V3: U30.56(PG0) ; port ENC0_Z_3V3
ENC1_A_3V3: U30.110(PA15) ; port ENC1_A_3V3
ENC1_B_3V3: U30.97(PC7) ; port ENC1_B_3V3
ENC1_Z_3V3: U30.11(PF1) ; port ENC1_Z_3V3
ENC2_A_3V3: U30.18(PF6) ; port ENC2_A_3V3
ENC2_B_3V3: U30.19(PF7) ; port ENC2_B_3V3
ENC2_Z_3V3: U30.87(PG2) ; port ENC2_Z_3V3
ENC3_A_3V3: U30.49(PF11) ; port ENC3_A_3V3
ENC3_B_3V3: U30.50(PF12) ; port ENC3_B_3V3
ENC3_Z_3V3: U30.92(PG7) ; port ENC3_Z_3V3
ENN_A: U30.141(PE0) ; port ENN_A
ENN_B: U30.142(PE1) ; port ENN_B
ENN_C: U30.59(PE8) ; port ENN_C
ENN_X: U30.10(PF0) ; port ENN_X
ENN_Y: U30.12(PF2) ; port ENN_Y
ENN_Z: U30.58(PE7) ; port ENN_Z
FD/HLD: U30.93(PG8) ; port FD/HLD
HALT: R134.1 U30.104(PA12) ; port HALT  [project net HALT_n]
KPSTR: R122.1 U30.63(PE10) ; port KPSTR
MIST: U30.9(PC15-OSC32_OUT) ; port MIST
NEOPIXEL1: U30.4(PE5) ; port NEOPIXEL1
NEOPIXEL2: U30.20(PF8) ; port NEOPIXEL2
PH_OSC_IN: C90.2 U30.23(PH0-OSC_IN) Y1.3(CRYSTAL_2)
PH_OSC_OUT: C89.2 U30.24(PH1-OSC_OUT) Y1.1(CRYSTAL_1)
PROBE: U30.3(PE4) ; port PROBE
PRU_RESET: U30.86(PD15) ; port PRU_RESET
RMII_CRS_DV: U30.43(PA7) ; sheet Ethernet/RMII_CRS_DV
RMII_MDC: U30.27(PC1) ; sheet Ethernet/RMII_MDC
RMII_MDIO: U30.36(PA2) ; sheet Ethernet/RMII_MDIO
RMII_REF_CLK: U30.35(PA1) ; sheet Ethernet/RMII_REF_CLK
RMII_RXD0: U30.44(PC4) ; sheet Ethernet/RMII_RXD0
RMII_RXD1: U30.45(PC5) ; sheet Ethernet/RMII_RXD1
RMII_TX_EN: U30.126(PG11) ; sheet Ethernet/RMII_TX_EN
RMII_TXD0: U30.128(PG13) ; sheet Ethernet/RMII_TXD0
RMII_TXD1: U30.127(PG12) ; sheet Ethernet/RMII_TXD1
RXD_EXT: U30.124(PG9) ; port RXD_EXT
RXD_INT: U30.102(PA10) ; port RXD_INT
SCL: R124.1 U20.6(SCL) U30.54(PF14) ; port SCL
SD_CLK: R31.2 SD1.5(CLK)
SD_CMD: SD1.3(CMD) U30.116(PD2)
SD_D0: R30.2 SD1.7(DAT0)
SDA: R123.1 U20.5(SDA) U30.55(PF15) ; port SDA
SG_A: U30.7(PC13) ; port SG_A
SG_B: U30.132(PG15) ; port SG_B
SG_C: U30.14(PF4) ; port SG_C
SG_X: U30.15(PF5) ; port SG_X
SG_Y: U30.135(PB5) ; port SG_Y
SG_Z: U30.76(PB15) ; port SG_Z
SPI_CS_JOG_SW: U30.40(PA4) ; port SPI_CS_JOG_SW
SPINDLE_DIR: U30.99(PC9) ; port SPINDLE_DIR
SPINDLE_EN: U30.103(PA11) ; port SPINDLE_EN
SPINDLE_PWM: U30.100(PA8) ; port SPINDLE_PWM
STEP_A: U30.122(PD6) ; port STEP_A
STEP_B: U30.123(PD7) ; port STEP_B
STEP_C: U30.77(PD8) ; port STEP_C
STEP_X: U30.117(PD3) ; port STEP_X
STEP_Y: U30.118(PD4) ; port STEP_Y
STEP_Z: U30.119(PD5) ; port STEP_Z
STM_BOOT0: C78.2 R131.1 SW5.1 U30.138(BOOT0) ; port STM_BOOT0
STM_NRST: C79.2 J6.10 P37.10 R120.1 SW6.1 SW6.3 U30.25(~{RST}) ; port STM_RESET, sheet Ethernet/NRST, sheet USB ULPI/RESETn  [project net STM_RESET]
SWCLK: J6.4 P37.4 U30.109(PA14) ; port AUXOUT_2  [project net AUXOUT_2]
SWDIO: J6.2 P37.2 U30.105(PA13) ; port AUXOUT_3  [project net AUXOUT_3]
TMC_SPI_CLK: R167.2 ; port SPI_MOTOR.SPI_CLK  [project net SPI_MOTOR.SPI_CLK]
TMC_SPI_PICO: R170.1 ; port SPI_MOTOR.SPI_PICO  [project net SPI_MOTOR.SPI_PICO]
TMC_SPI_POCI: R168.2 ; port SPI_MOTOR.SPI_POCI  [project net SPI_MOTOR.SPI_POCI]
TOOL: U30.134(PB4) ; port TOOL
TXD_EXT: U30.96(PC6) ; port TXD_EXT
TXD_INT: U30.101(PA9) ; port TXD_INT
ULPI_CLKOUT: U30.41(PA5) ; sheet USB ULPI/ULPI_CLKOUT
ULPI_D0: U30.37(PA3) ; sheet USB ULPI/ULPI_D0
ULPI_D1: U30.46(PB0) ; sheet USB ULPI/ULPI_D1
ULPI_D2: U30.47(PB1) ; sheet USB ULPI/ULPI_D2
ULPI_D3: U30.69(PB10) ; sheet USB ULPI/ULPI_D3
ULPI_D4: U30.70(PB11) ; sheet USB ULPI/ULPI_D4
ULPI_D5: U30.73(PB12) ; sheet USB ULPI/ULPI_D5
ULPI_D6: U30.74(PB13) ; sheet USB ULPI/ULPI_D6
ULPI_D7: U30.136(PB6) ; sheet USB ULPI/ULPI_D7
ULPI_DIR: U30.28(PC2_C) ; sheet USB ULPI/ULPI_DIR
ULPI_NXT: U30.29(PC3_C) ; sheet USB ULPI/ULPI_NXT
ULPI_STP: U30.26(PC0) ; sheet USB ULPI/ULPI_STP
USART_RX: U30.1(PE2) ; port USART10_RX
USART_TX: U30.2(PE3) ; port USART10_TX
X_LIM: U30.90(PG5) ; port X_LIM
Y_LIM: U30.21(PF9) ; port Y_LIM
Z_LIM: U30.53(PF13) ; port Z_LIM
NetC76_2: C76.2 U30.71(VCAP)
NetC77_2: C77.2 U30.106(VCAP)
NetR30_1: R30.1 U30.98(PC8)
NetR31_1: R31.1 U30.113(PC12)
NetR33_2: R33.2 U30.5(PE6)
NetR34_2: R34.2 U30.65(PE12)
NetR36_2: R36.2 U30.66(PE13)
NetR167_1: R167.1 U30.111(PC10)
NetR168_1: R168.1 U30.112(PC11)
NetR170_2: R170.2 U30.48(PB2)

Not connected (* = marked no-connect by the designer): J6 3 6 7 8 9; P37 6 7 8 9; SD1 1(DAT2) 2(CD/DAT3) 8(DAT1) 9(CD_A) 10(CD_B); SW5 3 MP1 MP2; SW6 MP1 MP2

### Notes on the sheet
- SPI6
- SPI3
- (near SD1) SD Card uses SPI3
- (near U30) SPI3 routes to RPI header. Also used for SD card.
  SPI 6 is used for TMC
  SPI2 is TBD.
- Try to set it up so that CAN is going to motor drivers.
- TIM3
- USART6
- USART1
- TIM2
- TIM4
- FDCAN3
- PG13
- PG12
- PC4
- PC5
- USART10
- PA2
- PG11
- PA7
- SPI4
- PC1
- PA1
- TIM23
- TIM24
- (near U20) EEPROM storage
- (near U30) Remember only 16 interrups
  0 INDEX 0
  1 INDEX 1
  2 INDEX 2
  3 C_LIM
  4 SPI_CS/JOG_SW
  5 X_LIM
  6 A_LIM
  7 INDEX 3
  8 FD/HLD
  9 YLIM
  10 KPSTR
  11 CYC/ST
  12 HALT
  13 Z_LIM
  14 B_LIM
  15 DOOR
- STM32H723 MCU
- Expatria Technologies
- SHEET
- PROJECT
- REV
- 1136 Glade Court
- Port Coquitlam, BC V3B 1R5
- EMAIL: INFO@EXPATRIA.CA
- SIZE
- ENGR
- C
- MODIFIED
- DOCUMENT
- /
- Copyright Expatria Technologies 2023. This document describes Open Hardware and is licensed under the CERN-OHL-S v2. No warranty is implied or expressed.
- (in symbol TF-022) CD/; DAT3; SD CARD

### Library data of the parts
C12 C74 = 1206 10uF (106) 10% 50V: Chip capacitors; Manufacturer: Samsung Electro-Mechanics; PartNumber: CL31A106KBHNNNE; Tolerance: 10%; Voltage: 50V; ComponentLink1Description: Supplier link; ComponentLink1URL: http://www.szlcsc.com/product/details_14236.html; Package: 1206; Supplier: LC; SuppliersPartNumber: C13585; Capacitance: 10uF; Manufacturer 1: Samsung Electro-Mechanics
C17 = 0603 4.7uF (475) 10% 16V: 16V 4.7uF X5R ±10% 0603 Multilayer Ceramic Capacitors MLCC - SMD/SMT ROHS; Manufacturer: Samsung Electro-Mechanics; Manufacturer Part Number: CL10A475KO8NNNC; ComponentLink1Description: Supplier link; ComponentLink1URL: http://www.szlcsc.com/product/details_20375.html; Package: 0603; Supplier: LC; SuppliersPartNumber: C19666; Capacitance: 4.7uF; Tolerance: 10%; Voltage: 16V
C18 = 0402 1.0uF (105) 10% 25V: Chip capacitor; Manufacturer: Samsung Electro-Mechanics; Manufacturer Part Number: CL05A105KA5NQNC; Capacitance: 1uF; Tolerance: 10%; Voltage: 25V; ComponentLink1Description: Supplier link; ComponentLink1URL: http://www.szlcsc.com/product/details_53938.html; Package: 0402; Supplier: LC; SuppliersPartNumber: C52923
C22 = 0402 100nF (104) 10% 16V: 16V 100nF X7R ±10% 0402 Multilayer Ceramic Capacitors MLCC - SMD/SMT ROHS; Manufacturer: Samsung Electro-Mechanics; Manufacturer Part Number: CL05B104KO5NNNC; ComponentLink1Description: Supplier link; ComponentLink1URL: http://www.szlcsc.com/product/details_1877.html; Package: 0402; Supplier: LC; SuppliersPartNumber: C1525; Capacitance: 100nF; Tolerance: 10%; Voltage: 16V
C23 C81 = 0402 1.0uF (105) 10% 25V: Chip capacitor; Manufacturer: Samsung Electro-Mechanics; PartNumber: CL05A105KA5NQNC; Capacitance: 1uF; Tolerance: 10%; Voltage: 25V; ComponentLink1Description: Supplier link; ComponentLink1URL: http://www.szlcsc.com/product/details_53938.html; Package: 0402; Supplier: LC; SuppliersPartNumber: C52923
C29-C32 C44 C57-C59 C82-C88 = 0402 100nF (104) 10% 16V: Chip capacitors; Manufacturer: Samsung Electro-Mechanics; PartNumber: CL05B104KO5NNNC; Tolerance: 10%; Voltage: 16V; ComponentLink1Description: Supplier link; ComponentLink1URL: http://www.szlcsc.com/product/details_1877.html; Package: 0402; Supplier: LC; SuppliersPartNumber: C1525; Capacitance: 100nF
C76 C77 = 0603 2.2uF (225) 10% 16V: Chip capacitors; Manufacturer: Samsung Electro-Mechanics; PartNumber: CL10A225KO8NNNC; Tolerance: 10%; Voltage: 16V; ComponentLink1Description: Supplier link; ComponentLink1URL: http://www.szlcsc.com/product/details_24366.html; Package: 0603; Supplier: LC; SuppliersPartNumber: C23630; Capacitance: 2.2uF
C78 C79 = 0603 100nF (104) 10% 50V: Chip capacitors; Manufacturer: YAGEO; PartNumber: CC0603KRX7R9BB104; Tolerance: 10%; Voltage: 50V; ComponentLink1Description: Supplier link; ComponentLink1URL: http://www.szlcsc.com/product/details_15331.html; Package: 0603; Supplier: LC; SuppliersPartNumber: C14663; Capacitance: 100nF
C80 = 0603 1uF (105) 10% 50V: Chip capacitors; Manufacturer: Samsung Electro-Mechanics; PartNumber: CL10A105KB8NNNC; Tolerance: 10%; Voltage: 50V; Package: 0603; Supplier: LC; SuppliersPartNumber: C15849; Capacitance: 1uF; ComponentLink1Description: Supplier link; ComponentLink1URL: http://www.szlcsc.com/product/details_16531.html
C89 C90 = 0402 10pF (100) 5% 50V: Chip capacitors; Manufacturer: Samsung Electro-Mechanics; PartNumber: CL05C100JB5NNNC; Tolerance: 5%; Voltage: 50V; ComponentLink1Description: Supplier link; ComponentLink1URL: http://www.szlcsc.com/product/details_33914.html; Package: 0402; Supplier: LC; SuppliersPartNumber: C32949; Capacitance: 10pF
J6 = TC2050-IDC: Connector; Manufacturer_Name: Tag Connect; Datasheet Link: https://datasheet.datasheetarchive.com/originals/distributors/Datasheets_SAMA/51f607a36a24a0aceedaa5d6ebc30014.pdf; Manufacturer_Part_Number: TC2050-IDC
P37 = CMP-1502-00948-1: THT Vertical Pin Header WR-PHD, Pitch 1.27 mm, Dual Row, 10 pins; Manufacturer: Wurth Elektronik; Rated Current: 1A; Pin Number: 10; Working Voltage: 100VAC; Contact Resistance: 20mOhm; Withstanding Voltage: 500VAC; Pitch: 1.27mm; Gender: Male; Mounting Technology: THT; Manufacturer URL: http://www.we-online.de; Package Reference: 62201021121; Row Number: Dual; Datasheet URL: https://katalog.we-online.de/em/datasheet/62201021121.pdf; Publisher: WurthElektronik; Packaging: Box; Operating Temperature: -40to105degC; Orientation: Vertical; Part Number: 62201021121
R30 R31 R33 R34 R36 R167 R168 R170 = 0402 22R (22R0) 1%: Chip resistor; Manufacturer: Uniroyal Elec; PartNumber: 0402WGF220JTCE; Power: 1/16W; ComponentLink1Description: Supplier link; ComponentLink1URL: http://www.szlcsc.com/product/details_25835.html; Package: 0402; Supplier: LC; SuppliersPartNumber: C25092; Resistance: 22Ω; Tolerance: 1%
R120 R122-R124 R134 = 0603 4.7K (4701) 1%: Chip resistor; Manufacturer: Uniroyal Elec; PartNumber: 0603WAF4701T5E; Power: 1/10W; ComponentLink1Description: Supplier link; ComponentLink1URL: http://www.szlcsc.com/product/details_23889.html; Package: 0603; Supplier: LC; SuppliersPartNumber: C23162; Resistance: 4.7KΩ; Tolerance: 1%
R131 = 0603 10K (1002) 1%: Chip resistor; Manufacturer: Uniroyal Elec; PartNumber: 0603WAF1002T5E; Power: 1/10W; ComponentLink1Description: Supplier link; ComponentLink1URL: http://www.szlcsc.com/product/details_26547.html; Package: 0603; Supplier: LC; SuppliersPartNumber: C25804; Resistance: 10KΩ; Tolerance: 1%
SD1 = TF-022: -40℃~+85℃ 1.28mm Gold plating Deck MicroSD card (TF card) Self bomb SMD SD Card Connectors ROHS; Manufacturer: Hanbo Electronic; SuppliersPartNumber: C2962373; Manufacturer Part Number: TF-022; Value: TF-022
SW5 SW6 = CMP-2000-07073-2: Side Push Type, 250 V, -40 to 90 degC, 3-Pin SMD, RoHS, Tape and Reel; Manufacturer: ALPS; Operating Force: 1.6N; Folder: Unified Components\Components\New Releases\New\; Maximum Current Rating: 0.05@12VDCA; RevisionId: 1; Pole Throw Configuration: SPST; Switch Configuration: N.O.; AccessRights: 2147483647; Maximum DC Voltage Rating: 12V; ContentType: Unified Component; Rad Hard: No; Mounting: SurfaceMount; Datasheet URL: http://www.alps.com/prod/info/E/PDF/Tact/SurfaceMount/SKRT/SKRT.PDF; Manufacturer URL: http://www.alps.com/e/; ReleaseDate: 22/09/2017 06:13:25 AM; ItemHRID: CMP-2000-07073; ContentTypeGUID: CB3C11C4-E317-11DF-B822-12313F0024A2; LifeCycle: Released; ItemGUID: EAC55BEC-37DC-4BDB-8BA7-D75E6D5C3D75; Packaging: Tape&Reel; Package Reference: SKRTLAE010; FolderGUID: B7F4506A-9127-42E7-A087-46FE7B18D116; Datasheet Version: 06/2015; Mounting Technology: SurfaceMount; LifeCycleStateGUID: 61E382EE-6656-4F12-9E24-BE9327104A25; Package Description: 3-Pin Surface Mount Device, Body 4.5 x 3.55 mm, Pitch 1.225 mm; SuppliersPartNumber: C110293; Manufacturer 1: ALPS
U20 = CMP-0159-00216-1: IC EEPROM 128KBIT I2C 8SOIC; SuppliersPartNumber: C918271
U30 = STM32H723ZGT6: IC MCU 32BIT 1MB FLASH 144LQFP; Manufacturer 1: STMicroelectronics; Manufacturer Part Number 1: STM32H723ZGT6
VR3 = SOT-223 AMS1117-3.3: Vout=3.3V 1A 72dB@(120Hz) (LDO); Manufacturer 1: AMS; ComponentLink1Description: 供应商链接; ComponentLink1URL: http://www.szlcsc.com/product/details_6652.html; Package: SOT-223; Supplier: LC; SuppliersPartNumber: C6186; Manufacturer Part Number 1: AMS1117-3.3
Y1 = YSX321SL: Crystal or Oscillator; Manufacturer_Name: Yangxing Tech; Manufacturer_Part_Number: X322525MSB4SI; Height: 0.8mm; SuppliersPartNumber: C13740

## Sheet Ethernet_Interface.SchDoc: STM32F446 CNC
size B; Author: AM; CompanyName: Expatria Technologies; DrawnBy: A.Marles; Engineer: AM; Organization: Expatria Technolgoies; Address1: PO Box 2084; Address3: Merritt, BC V1K 1B8; Address4: Canada; DocumentNumber: 7; Revision: A1; SheetNumber: 7; SheetTotal: 26
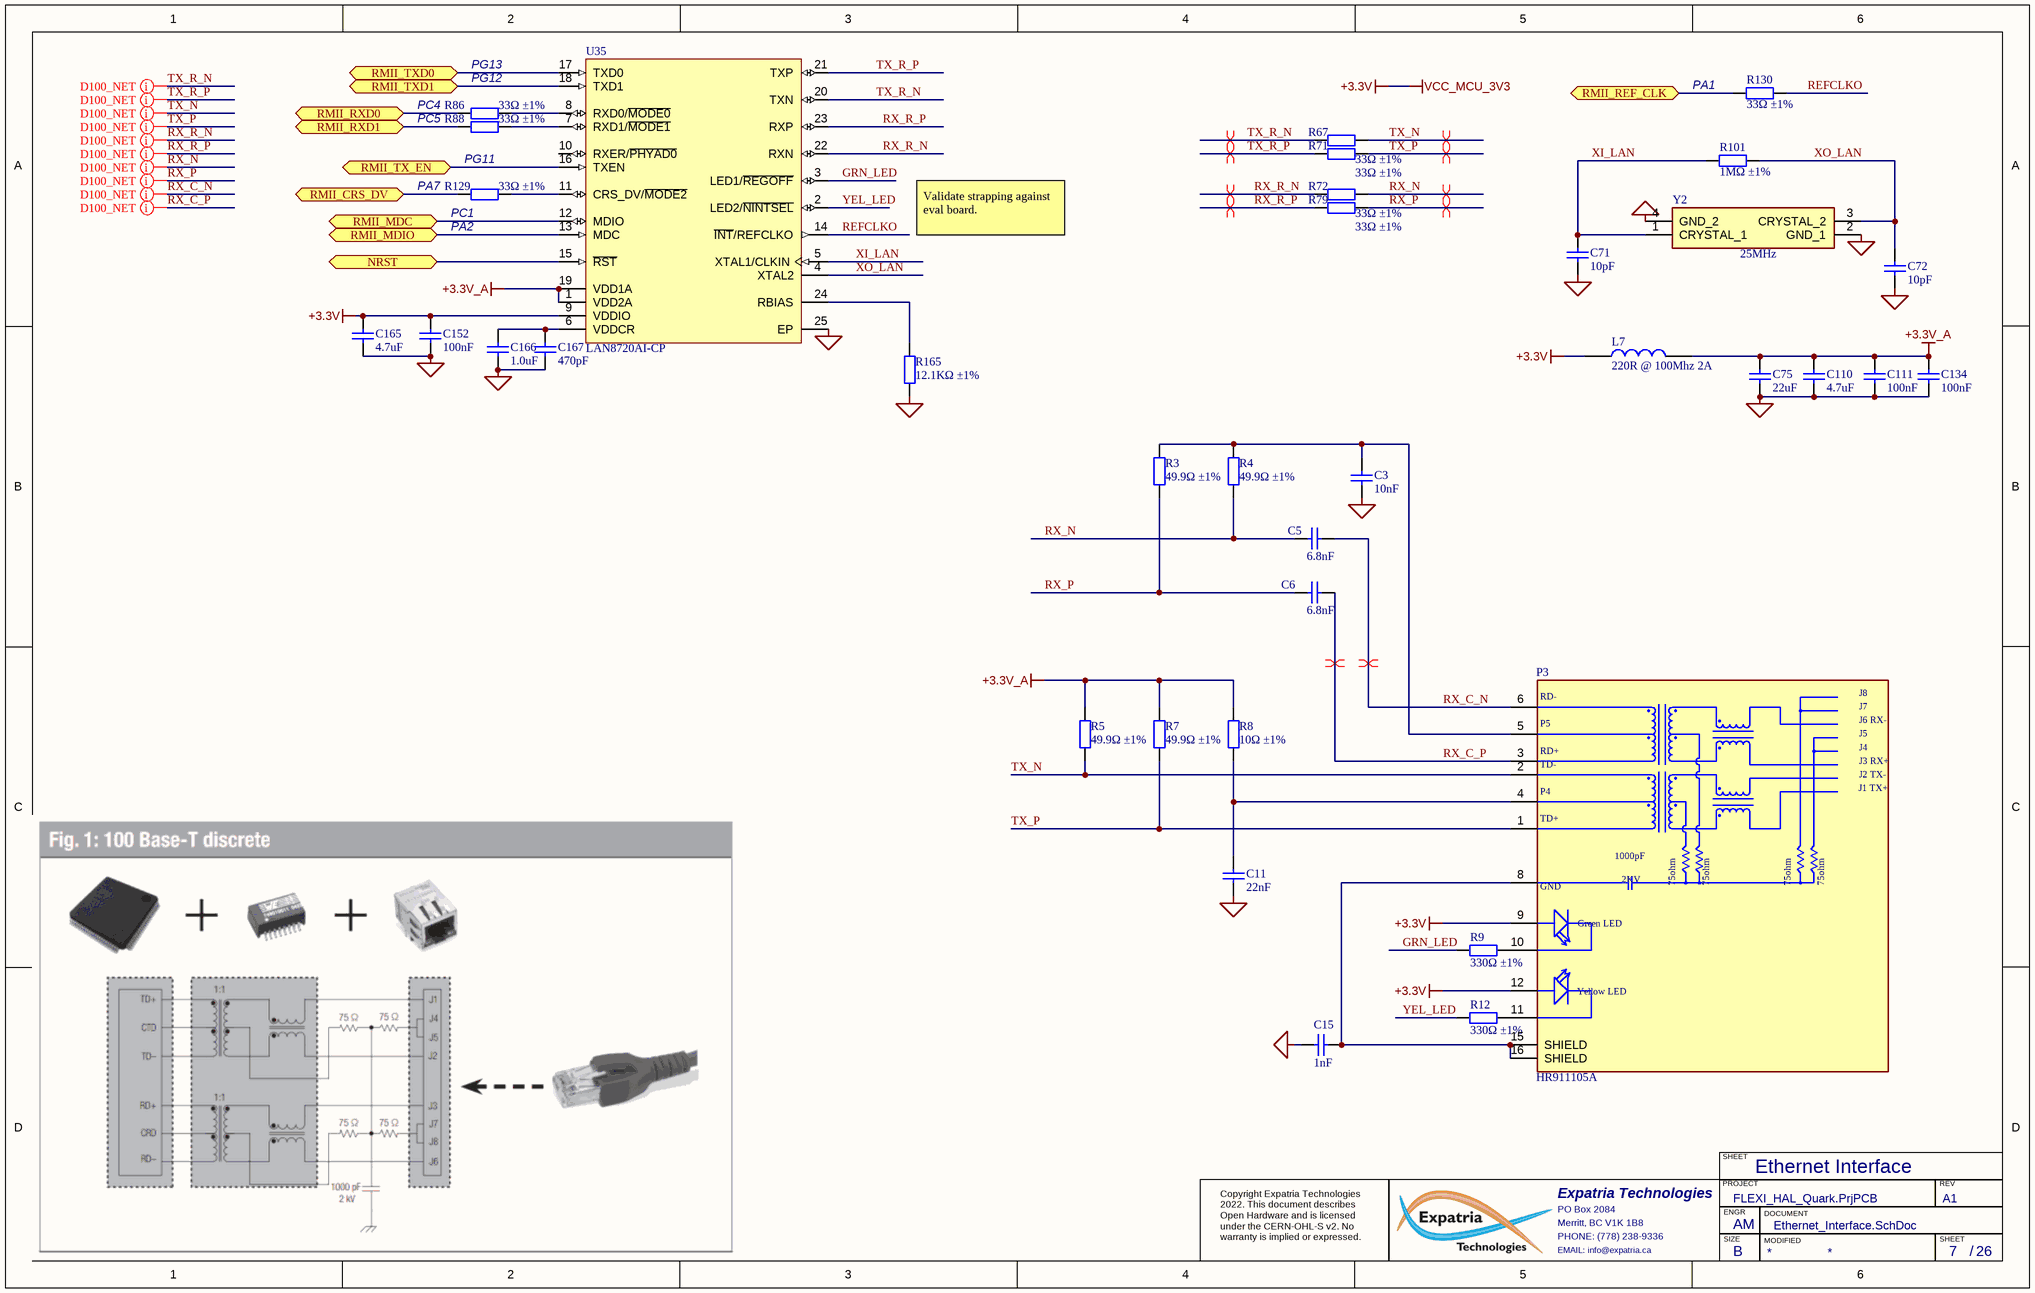
[diagram p9: Ethernet_Interface.SchDoc]

### Parts
C3  10nF  [0402_C]
C5  6.8nF  [0402_C]
C6  6.8nF  [0402_C]
C11  22nF  [0402_C]
C15  1nF  [1206_C]
C71  10pF  [0402_C]
C72  10pF  [0402_C]
C75  22uF  [0805_C]
C110  4.7uF  [0603_C]
C111  100nF  [0402_C]
C134  100nF  [0402_C]
C152  100nF  [0402_C]
C165  4.7uF  [0603_C]
C166  1.0uF  [0402_C]
C167  470pF  [0402_C]
L7  220R @ 100Mhz 2A  [0805_R]
P3  HR911105A  [HANRUN_HR911105A]
R3  49.9Ω ±1%  [0402_R]
R4  49.9Ω ±1%  [0402_R]
R5  49.9Ω ±1%  [0402_R]
R7  49.9Ω ±1%  [0402_R]
R8  10Ω ±1%  [0402_R]
R9  330Ω ±1%  [0402_R]
R12  330Ω ±1%  [0402_R]
R67  33Ω ±1%  [0402_R]
R71  33Ω ±1%  [0402_R]
R72  33Ω ±1%  [0402_R]
R79  33Ω ±1%  [0402_R]
R86  33Ω ±1%  [0402_R]
R88  33Ω ±1%  [0402_R]
R101  1MΩ ±1%  [0402_R]
R129  33Ω ±1%  [0402_R]
R130  33Ω ±1%  [0402_R]
R165  12.1KΩ ±1%  [0805_R]
U35  LAN8720AI-CP  [MCHP-QFN-24_V]
Y2  value 25MHz  [YSX321SL]  (hidden comment: X322525MSB4SI)

### Ports
NRST (bidir), RMII_CRS_DV (bidir), RMII_MDC (bidir), RMII_MDIO (bidir), RMII_REF_CLK (bidir), RMII_RXD0 (bidir), RMII_RXD1 (bidir), RMII_TX_EN (bidir), RMII_TXD0 (bidir), RMII_TXD1 (bidir)

### Nets
+3.3V: C152.2 C165.2 L7.1 P3.9(GA) P3.12(YA) U35.9(VDDIO)  [also labelled VCC_MCU_3V3]
+3.3V_A: C75.2 C110.2 C111.2 C134.2 L7.2 R5.1 R7.1 R8.1 U35.1(VDD2A) U35.19(VDD1A)
MCU_GND: C3.1 C11.1 C15.1 C71.1 C72.1 C75.1 C110.1 C111.1 C134.1 C152.1 C165.1 C166.1 C167.1 R165.1 U35.25(EP) Y2.2(GND_1) Y2.4(GND_2)
GRN_LED: R9.1 U35.3(LED1/~{REGOFF})
REFCLKO: R130.2 U35.14(~{INT}/REFCLKO)
RMII_CRS_DV: R129.1 ; port RMII_CRS_DV
RMII_MDC: U35.12(MDIO) ; port RMII_MDC
RMII_MDIO: U35.13(MDC) ; port RMII_MDIO
RMII_REF_CLK: R130.1 ; port RMII_REF_CLK
RMII_RXD0: R86.1 ; port RMII_RXD0
RMII_RXD1: R88.1 ; port RMII_RXD1
RMII_TX_EN: U35.16(TXEN) ; port RMII_TX_EN
RMII_TXD0: U35.17(TXD0) ; port RMII_TXD0
RMII_TXD1: U35.18(TXD1) ; port RMII_TXD1
RX_C_N: C5.1 P3.6(RD-)
RX_C_P: C6.1 P3.3(RD+)
RX_N: C5.2 R4.2 R72.1
RX_P: C6.2 R3.2 R79.1
RX_R_N: R72.2 U35.22(RXN)
RX_R_P: R79.2 U35.23(RXP)
STM_RESET: U35.15(~{RST}) ; port NRST
TX_N: P3.2(TD-) R5.2 R67.1
TX_P: P3.1(TD+) R7.2 R71.1
TX_R_N: R67.2 U35.20(TXN)
TX_R_P: R71.2 U35.21(TXP)
XI_LAN: C71.2 R101.1 U35.5(XTAL1/CLKIN) Y2.1(CRYSTAL_1)
XO_LAN: C72.2 R101.2 U35.4(XTAL2) Y2.3(CRYSTAL_2)
YEL_LED: R12.1 U35.2(LED2/~{NINTSEL})
NetC3_2: C3.2 P3.5(P5) R3.1 R4.1
NetC11_2: C11.2 P3.4(P4) R8.2
NetC15_2: C15.2 P3.8(GND) P3.15(SHIELD) P3.16(SHIELD)
NetC166_2: C166.2 C167.2 U35.6(VDDCR)
NetP3_10: P3.10(GC) R9.2
NetP3_11: P3.11(YC) R12.2
NetR86_2: R86.2 U35.8(RXD0/~{MODE0})
NetR88_2: R88.2 U35.7(RXD1/~{MODE1})
NetR129_2: R129.2 U35.11(CRS_DV/~{MODE2})
NetR165_2: R165.2 U35.24(RBIAS)

Not connected (* = marked no-connect by the designer): U35 10(RXER/~{PHYAD0})

### Layout directives
differential pair: RX_C_N, RX_C_P, RX_N, RX_P, RX_R_N, RX_R_P, TX_N, TX_P, TX_R_N, TX_R_P
net class D100_NET: RX_C_N, RX_C_P, RX_N, RX_P, RX_R_N, RX_R_P, TX_N, TX_P, TX_R_N, TX_R_P

### Notes on the sheet
- PG13
- PG12
- (near R130) PA1
- PC4
- PC5
- PG11
- (near R129) PA7
- (near R129) PC1
- (near R129) PA2
- Validate strapping against eval board.
- Ethernet Interface
- SHEET
- Expatria Technologies
- PO Box 2084
- Merritt, BC V1K 1B8
- PHONE: (778) 238-9336
- PROJECT
- SIZE
- ENGR
- MODIFIED
- DOCUMENT
- REV
- Copyright Expatria Technologies 2022. This document describes Open Hardware and is licensed under the CERN-OHL-S v2. No warranty is implied or expressed.
- EMAIL: info@expatria.ca
- B
- /
- (in symbol HR911105A) J8; J7; J6 RX-; J5; J4; J3 RX+; J2 TX-; J1 TX+; 1000pF; 2KV; 75ohm; Green LED; Yellow LED

### Library data of the parts
C3 = 0402 10nF (103) 10% 50V: Chip capacitors; Manufacturer: Samsung Electro-Mechanics; Manufacturer Part Number: CL05B103KB5NNNC; Tolerance: 10%; Voltage: 50V; ComponentLink1Description: Supplier link; ComponentLink1URL: http://www.szlcsc.com/product/details_15869.html; Package: 0402; Supplier: LC; SuppliersPartNumber: C15195; Capacitance: 10nF
C5 C6 = 0402 6.8nF (682) 10% 50V: Chip capacitors; Manufacturer: Guangdong Fenghua Advanced Tech; Manufacturer Part Number: 0402B682K500NT; Tolerance: 10%; Voltage: 50V; ComponentLink1Description: Supplier link; ComponentLink1URL: http://www.szlcsc.com/product/details_1894.html; Package: 0402; Supplier: LC; SuppliersPartNumber: C1542; Capacitance: 6.8nF
C11 = 0402 22nF (223) 10% 50V: Chip capacitors; Manufacturer: Guangdong Fenghua Advanced Tech; Manufacturer Part Number: 0402B223K500NT; Tolerance: 10%; Voltage: 50V; ComponentLink1Description: Supplier link; ComponentLink1URL: http://www.szlcsc.com/product/details_1884.html; Package: 0402; Supplier: LC; SuppliersPartNumber: C1532; Capacitance: 22nF
C15 = 1206 1nF (102) 10% 500V: Chip capacitors; Manufacturer: Samsung Electro-Mechanics; Manufacturer Part Number: CL31B102KGFNNNE; Tolerance: 10%; Voltage: 500V; ComponentLink1Description: Supplier link; ComponentLink1URL: http://www.szlcsc.com/product/details_36187.html; Package: 1206; Supplier: LC; SuppliersPartNumber: C35216; Capacitance: 1nF
C71 C72 = 0402 10pF (100) 5% 50V: Chip capacitors; Manufacturer: Samsung Electro-Mechanics; Manufacturer Part Number: CL05C100JB5NNNC; Tolerance: 5%; Voltage: 50V; ComponentLink1Description: Supplier link; ComponentLink1URL: http://www.szlcsc.com/product/details_33914.html; Package: 0402; Supplier: LC; SuppliersPartNumber: C32949; Capacitance: 10pF
C75 = 0805 22uF (226) 20% 25V: 25V 22uF X5R ±20% 0805 Multilayer Ceramic Capacitors MLCC - SMD/SMT ROHS; Manufacturer: Samsung Electro-Mechanics; Manufacturer Part Number: CL21A226MAQNNNE; ComponentLink1Description: Supplier link; ComponentLink1URL: http://www.szlcsc.com/product/details_46786.html; Package: 0805; Supplier: LC; SuppliersPartNumber: C45783; Capacitance: 22uF; Tolerance: 20%; Voltage: 25V
C110 C165 = 0603 4.7uF (475) 10% 16V: as C17 on sheet MCU_STM32H723ZGT6; ComponentLink1Description: Supplier link; ComponentLink1URL: http://www.szlcsc.com/product/details_20375.html; Package: 0603; Supplier: LC; SuppliersPartNumber: C19666; Capacitance: 4.7uF; Tolerance: 10%; Voltage: 16V
C111 C134 C152 = 0402 100nF (104) 10% 16V: as C22 on sheet MCU_STM32H723ZGT6; ComponentLink1Description: Supplier link; ComponentLink1URL: http://www.szlcsc.com/product/details_1877.html; Package: 0402; Supplier: LC; SuppliersPartNumber: C1525; Capacitance: 100nF; Tolerance: 10%; Voltage: 16V
C166 = 0402 1.0uF (105) 10% 25V: as C23 on sheet MCU_STM32H723ZGT6; ComponentLink1Description: Supplier link; ComponentLink1URL: http://www.szlcsc.com/product/details_53938.html; Package: 0402; Supplier: LC; SuppliersPartNumber: C52923
C167 = 0402 470pF (471) 10% 50V: Chip capacitors; Manufacturer: Guangdong Fenghua Advanced Tech; PartNumber: 0402B471K500NT; Tolerance: 10%; Voltage: 50V; ComponentLink1Description: Supplier link; ComponentLink1URL: http://www.szlcsc.com/product/details_1889.html; Package: 0402; Supplier: LC; SuppliersPartNumber: C1537; Capacitance: 470pF
L7 = CBW201209U221T: 150mΩ ±25% 220Ω@100MHz 0805 Ferrite Beads ROHS; Manufacturer: FH (Guangdong Fenghua Advanced Tech); Package: 0402; Supplier: LC; SuppliersPartNumber: C139188; Manufacturer Part Number: CBW201209U221T
P3 = HR911105A: HR911105A Ethernet Interface Arduino Platform Evaluation Expansion Board; Manufacturer: DFRobot; SuppliersPartNumber: C163507; Value: HR911105A; Manufacturer Part Number: HR911105A
R3-R5 R7 = 0402 49.9R (49R9) 1%: Chip resistor; Manufacturer: Uniroyal Elec; Manufacturer Part Number: 0402WGF499JTCE; Power: 1/16W; ComponentLink1Description: Supplier link; ComponentLink1URL: http://www.szlcsc.com/product/details_25863.html; Package: 0402; Supplier: LC; SuppliersPartNumber: C25120; Resistance: 49.9Ω; Tolerance: 1%
R8 = 0402 10R (10R0) 1%: Chip resistor; Manufacturer: Uniroyal Elec; Manufacturer Part Number: 0402WGF100JTCE; Power: 1/16W; ComponentLink1Description: Supplier link; ComponentLink1URL: http://www.szlcsc.com/product/details_25820.html; Package: 0402; Supplier: LC; SuppliersPartNumber: C25077; Resistance: 10Ω; Tolerance: 1%
R9 R12 = 0402 330R (3300) 1%: Chip resistor; Manufacturer: Uniroyal Elec; Manufacturer Part Number: 0402WGF3300TCE; Power: 1/16W; ComponentLink1Description: Supplier link; ComponentLink1URL: http://www.szlcsc.com/product/details_25847.html; Package: 0402; Supplier: LC; SuppliersPartNumber: C25104; Resistance: 330Ω; Tolerance: 1%
R67 R71 R72 R79 R86 R88 R129 R130 = 0402 33R (33R0) 1%: Chip resistor; Manufacturer: Uniroyal Elec; Manufacturer Part Number: 0402WGF330JTCE; Power: 1/16W; ComponentLink1Description: Supplier link; ComponentLink1URL: http://www.szlcsc.com/product/details_25848.html; Package: 0402; Supplier: LC; SuppliersPartNumber: C25105; Resistance: 33Ω; Tolerance: 1%
R101 = 0402 1M (1004) 1%: Chip resistor; Manufacturer: Uniroyal Elec; Manufacturer Part Number: 0402WGF1004TCE; Power: 1/16W; ComponentLink1Description: Supplier link; ComponentLink1URL: http://www.szlcsc.com/product/details_26826.html; Package: 0402; Supplier: LC; SuppliersPartNumber: C26083; Resistance: 1MΩ; Tolerance: 1%
R165 = 0805 12.1K (1212) 1%: Chip resistor; Manufacturer: Uniroyal Elec; Power: 1/8W; ComponentLink1Description: Supplier link; ComponentLink1URL: https://item.szlcsc.com/18119.html; Package: 0805; Supplier: LC; SuppliersPartNumber: C17431; Tolerance: 1%
U35 = CMP-2000-05216-1: RMII 10/100 Ethernet Transceiver with HP Auto-MDIX Support, -40 to 85 degC, 24-Pin QFN, RoHS, Tray; Manufacturer: Microchip; Number of Drivers/Receivers: 4/4; Other Names: 638-1084; Dynamic Catalog: PhysicalLayerTransceiver; Voltage - Supply: 1.6V~3.6V; Package Reference: QFN-24; Series: -; Protocol: RMII; Packaging: Tray; Datasheet URL: http://ww1.microchip.com/downloads/en/DeviceDoc/8720a.pdf; Package Description: 24-Pin Quad Flat No-lead Package, Body 4 x 4 mm, Pitch 0.5 mm; Mounting Type: SurfaceMount; Package / Case: 24-VFQFNExposedPad; Category: IntegratedCircuits(ICs); Family: Interface-Drivers,Receivers,Transceivers; Type: Transceiver; Supplier Device Package: 24-QFN(4x4); Manufacturer URL: http://www.microchip.com/; Datasheet Version: Rev. 1.4, 08/2012; Standard Package: 490
Y2 = X322525MSB4SI: 25MHz SMD Crystal Resonator 20pF ±10ppm ±30ppm -40℃~+85℃ SMD3225-4P Crystals ROHS; Manufacturer 1: Yangxing Tech; Height: 0.8mm; SuppliersPartNumber: C13740; Supplier 1: LCSC; Supplier Part Number 1: C13740; Manufacturer Part Number 1: X322525MSB4SI; Manufacturer: Yangxing Tech; Manufacturer Part Number: X322525MSB4SI